# EAGLE design board (EAGLE 9.4.2)

## Sheet 1 of 5: Logika a konektory -ESP32 -konektor na GPS, motor zamku, vivod i2c a zbyle pinhedy pro externi pouyiti
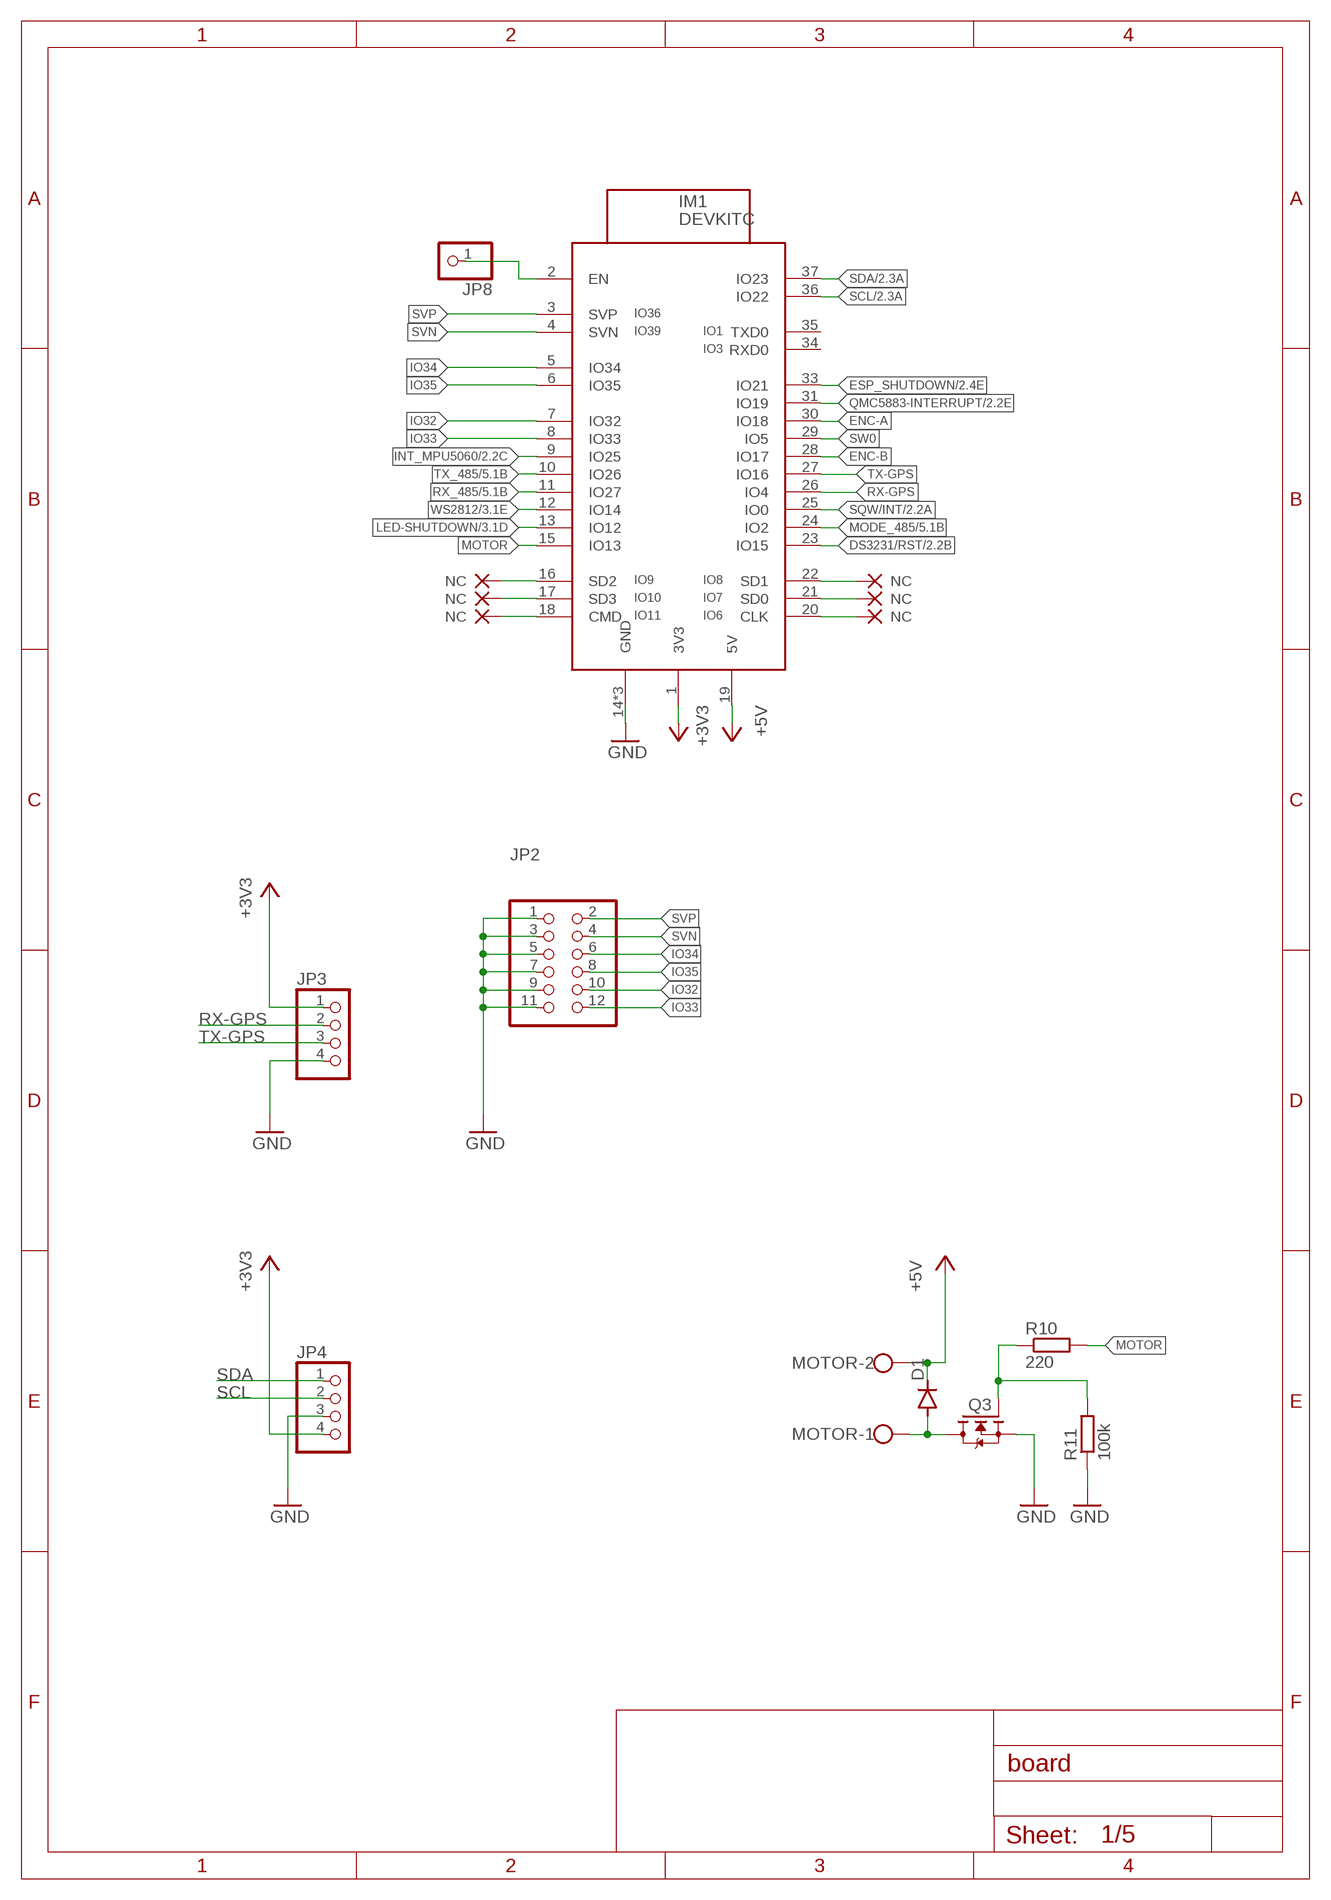
[diagram p0: schematic, sheet 1]

### Parts
D1  DIODE-DO214BA  [DO214BA]
IM1  DEVKITC  [DEVKITC]
JP2  PINHD-2X6  [2X06]
JP3  PINHD-1X4  [1X04]
JP4  PINHD-1X4  [1X04]
JP8  PINHD-1X1  [1X01]
MOTOR  W237-102  [W237-102]
NC1  NC  (no package)
NC2  NC  (no package)
NC3  NC  (no package)
NC4  NC  (no package)
NC5  NC  (no package)
NC6  NC  (no package)
Q3  N-MOSFET-SO8  [SO-8]
R10  220  R-EU_R0402  [R0402]
R11  100k  R-EU_R0402  [R0402]

### Nets
+3V3: IM1.1(3V3) JP3.1 JP4.4 ; also sheet 2,3,5
+5V: D1.C IM1.19(5V) MOTOR.2 ; also sheet 2,3,5
DS3231/RST: IM1.23(IO15) ; also sheet 2
ENC-A: IM1.30(IO18) ; also sheet 2
ENC-B: IM1.28(IO17) ; also sheet 2
ESP_SHUTDOWN: IM1.33(IO21) ; also sheet 2
GND: IM1.14(GND) IM1.32(GND) IM1.38(GND) JP2.1 JP2.3 JP2.5 JP2.7 JP2.9 JP2.11 JP3.4 JP4.3 Q3.1(S) Q3.2(S) Q3.3(S) R11.1 ; also sheet 2,3,4,5
INT_MPU5060: IM1.9(IO25) ; also sheet 2
IO9_NC: IM1.16(SD2) NC1.NC
IO9_NC1: IM1.20(CLK) NC4.NC
IO10_NC: IM1.17(SD3) NC2.NC
IO10_NC1: IM1.21(SD0) NC5.NC
IO11_NC: IM1.18(CMD) NC3.NC
IO11_NC1: IM1.22(SD1) NC6.NC
IO32: IM1.7(IO32) JP2.10
IO33: IM1.8(IO33) JP2.12
IO34: IM1.5(IO34) JP2.6
IO35: IM1.6(IO35) JP2.8
LED-SHUTDOWN: IM1.13(IO12) ; also sheet 3
MODE_485: IM1.24(IO2) ; also sheet 5
MOTOR: IM1.15(IO13) R10.2
N$2: D1.A MOTOR.1 Q3.5(D) Q3.6(D) Q3.7(D) Q3.8(D)
N$10: IM1.2(EN) JP8.1
N$71: Q3.4(G) R10.1 R11.2
QMC5883-INTERRUPT: IM1.31(IO19) ; also sheet 2
RX-GPS: IM1.26(IO4) JP3.2
RX_485: IM1.11(IO27) ; also sheet 5
SCL: IM1.36(IO22) JP4.2 ; also sheet 2
SDA: IM1.37(IO23) JP4.1 ; also sheet 2
SQW/INT: IM1.25(IO0) ; also sheet 2
SVN: IM1.4(SVN) JP2.4
SVP: IM1.3(SVP) JP2.2
SW0: IM1.29(IO5) ; also sheet 2
TX-GPS: IM1.27(IO16) JP3.3
TX_485: IM1.10(IO26) ; also sheet 5
WS2812: IM1.12(IO14) ; also sheet 3
Unconnected: IM1.34(RXD0) IM1.35(TXD0)

## Sheet 2 of 5
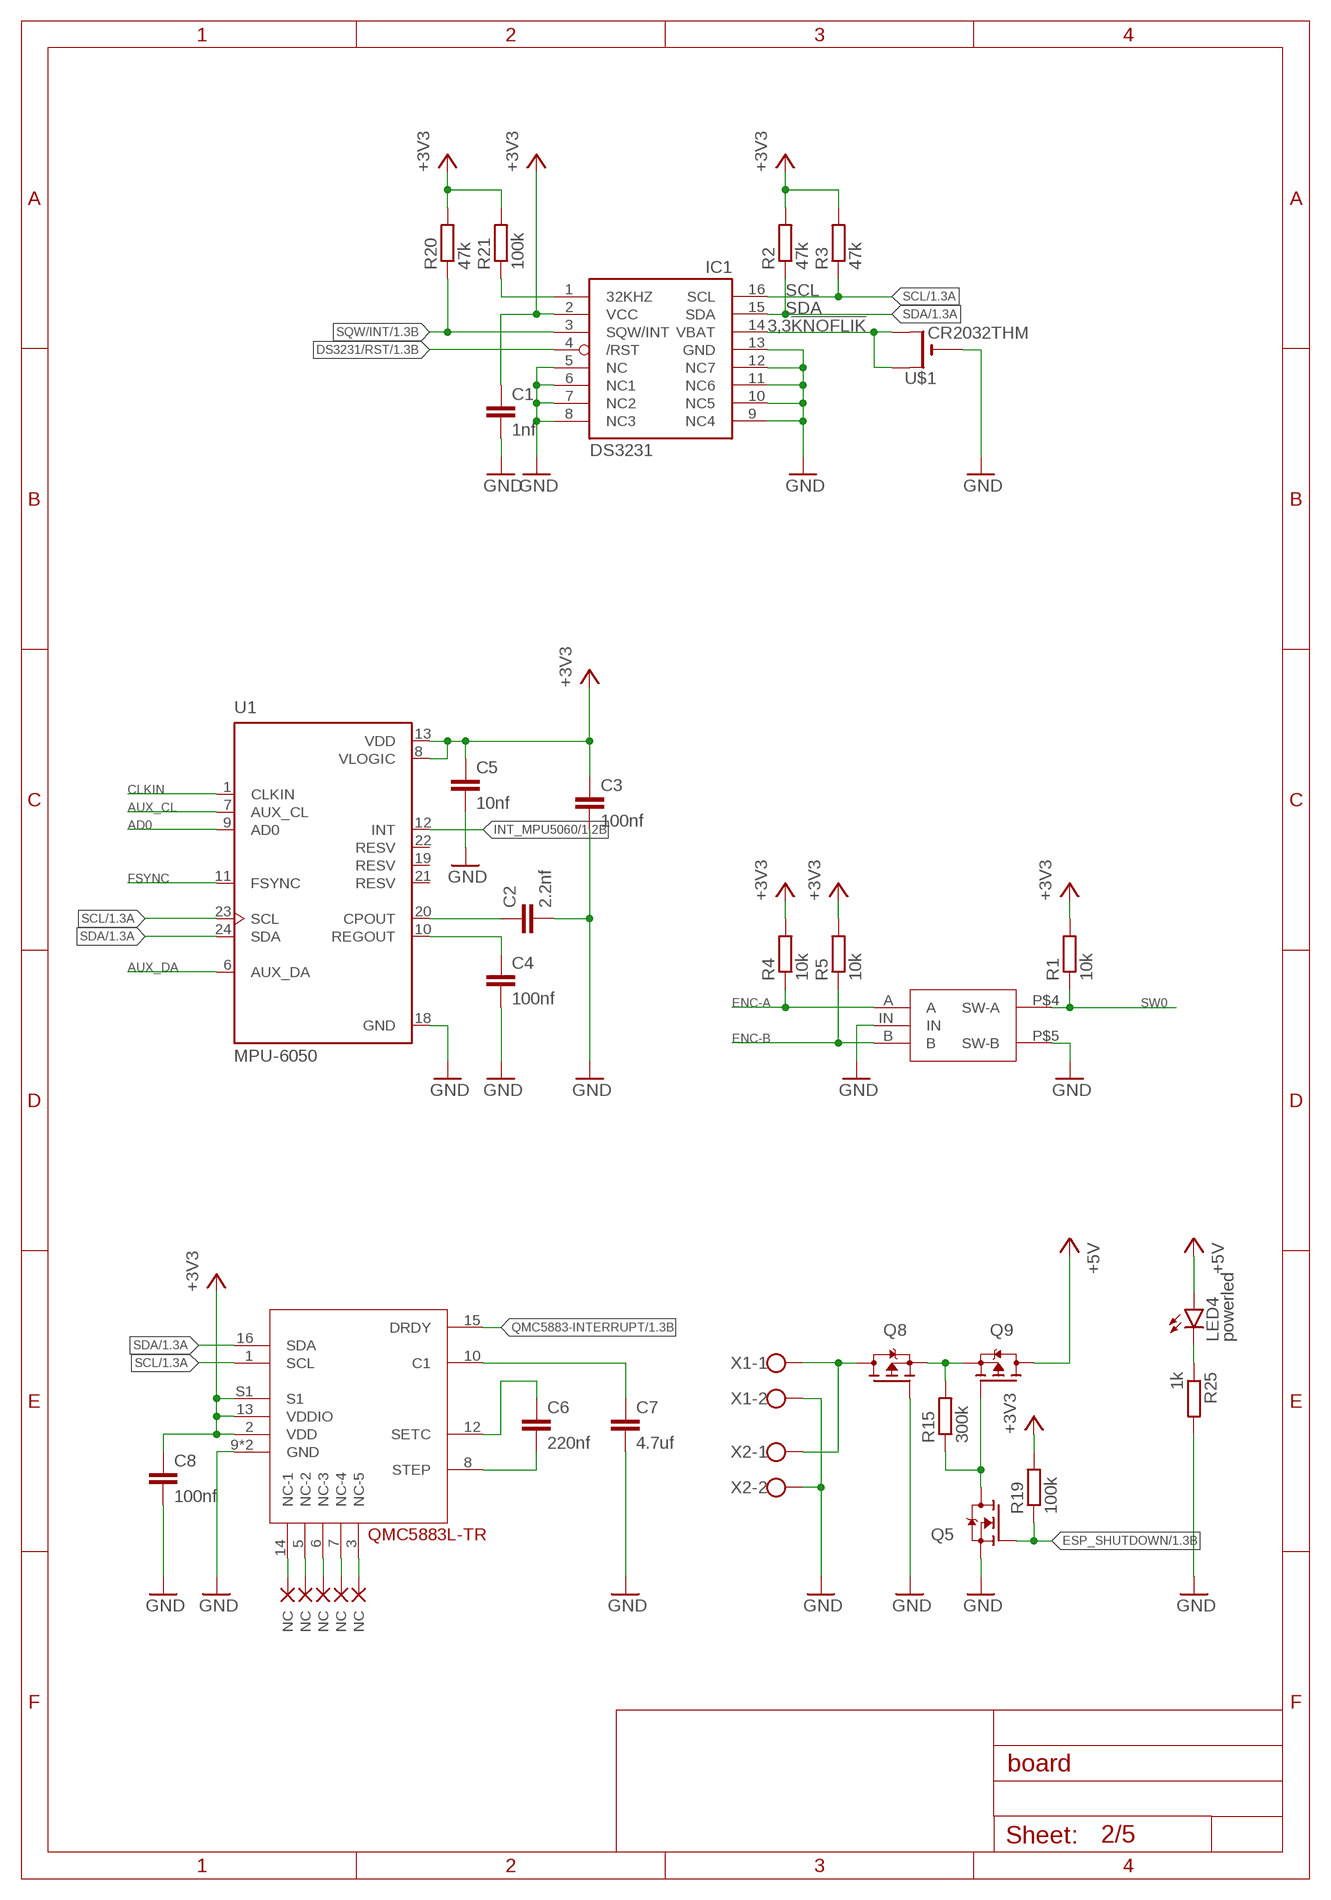
[diagram p1: schematic, sheet 2]

### Parts
C1  1nf  C-EUC0402K  [C0402K]
C2  2.2nf  C-EUC0402K  [C0402K]
C3  100nf  C-EUC0402K  [C0402K]
C4  100nf  C-EUC0402K  [C0402K]
C5  10nf  C-EUC0402K  [C0402K]
C6  220nf  C-EUC0402K  [C0402K]
C7  4.7uf  C-EUC0603  [C0603]
C8  100nf  C-EUC0402K  [C0402K]
IC1  DS3231/SO  [SO16W]
IC2  QMC5883L-TR  [QMC5882L-TR]
LED4  powerled  LEDSML0603  [SML0603]
NC7  NC  (no package)
NC9  NC  (no package)
NC10  NC  (no package)
NC11  NC  (no package)
NC12  NC  (no package)
Q5  N-MOSFET-SOT23-GSD  [SOT23]
Q8  BSO201SP  [SO-8]
Q9  BSO201SP  [SO-8]
R1  10k  R-EU_R0402  [R0402]
R2  47k  R-EU_R0402  [R0402]
R3  47k  R-EU_R0402  [R0402]
R4  10k  R-EU_R0402  [R0402]
R5  10k  R-EU_R0402  [R0402]
R15  300k  R-EU_R0603  [R0603]
R19  100k  R-EU_R0402  [R0402]
R20  47k  R-EU_R0603  [R0603]
R21  100k  R-EU_R0603  [R0603]
R25  1k  R-EU_R0402  [R0402]
U1  MPU-6050  [QFN50P400X400X95-24N]
U$1  CR2032THM  [CR2032-THRU]
U$62  EC11-1S  [EC11-1S]
X1  W237-102  [W237-102]
X2  W237-102  [W237-102]

### Nets
3,3!KNOFLIK: IC1.14(VBAT) U$1.+1(+) U$1.+2(+1)
+3V3: C1.1 C3.1 C5.1 C8.1 IC1.2(VCC) IC2.2(VDD) IC2.13(VDDIO) IC2.S1 R1.2 R2.2 R3.2 R4.2 R5.2 R19.2 R20.2 R21.2 U1.8(VLOGIC) U1.13(VDD) ; also sheet 1,3,5
+5V: LED4.A Q9.5(D) Q9.6(D) Q9.7(D) Q9.8(D) ; also sheet 1,3,5
AD0: U1.9(AD0)
AUX_CL: U1.7(AUX_CL)
AUX_DA: U1.6(AUX_DA)
CLKIN: U1.1(CLKIN)
DS3231/RST: IC1.4(/RST) ; also sheet 1
ENC-A: R4.1 U$62.A ; also sheet 1
ENC-B: R5.1 U$62.B ; also sheet 1
ESP_SHUTDOWN: Q5.1(G) R19.1 ; also sheet 1
FSYNC: U1.11(FSYNC)
GND: C1.2 C2.2 C3.2 C4.2 C5.2 C7.2 C8.2 IC1.5(NC) IC1.6(NC1) IC1.7(NC2) IC1.8(NC3) IC1.9(NC4) IC1.10(NC5) IC1.11(NC6) IC1.12(NC7) IC1.13(GND) IC2.9(GND) IC2.11(GND) Q5.2(S) Q8.4(G) R25.2 U1.18(GND) U$1.- U$62.IN U$62.P$5(SW-B) X1.2 X2.2 ; also sheet 1,3,4,5
INT_MPU5060: U1.12(INT) ; also sheet 1
IO9_NC2: IC2.14(NC-1) NC7.NC
IO9_NC3: IC2.7(NC-4) NC11.NC
IO10_NC2: IC2.5(NC-2) NC9.NC
IO10_NC3: IC2.3(NC-5) NC12.NC
IO11_NC2: IC2.6(NC-3) NC10.NC
LED4: LED4.C R25.1
N$1: C2.1 U1.20(CPOUT)
N$3: C4.1 U1.10(REGOUT)
N$4: Q8.5(D) Q8.6(D) Q8.7(D) Q8.8(D) X1.1 X2.1
N$5: Q8.1(S) Q8.2(S) Q8.3(S) Q9.1(S) Q9.2(S) Q9.3(S) R15.2
N$6: Q5.3(D) Q9.4(G) R15.1
N$7: IC1.1(32KHZ) R21.1
N$60: C6.1 IC2.12(SETC)
N$62: C6.2 IC2.8(STEP)
N$66: C7.1 IC2.10(C1)
QMC5883-INTERRUPT: IC2.15(DRDY) ; also sheet 1
SCL: IC1.16(SCL) IC2.1(SCL) R3.1 U1.23(SCL) ; also sheet 1
SDA: IC1.15(SDA) IC2.16(SDA) R2.1 U1.24(SDA) ; also sheet 1
SQW/INT: IC1.3(SQW/INT) R20.1 ; also sheet 1
SW0: R1.1 U$62.P$4(SW-A) ; also sheet 1
Unconnected: U1.19(RESV) U1.21(RESV) U1.22(RESV)

## Sheet 3 of 5
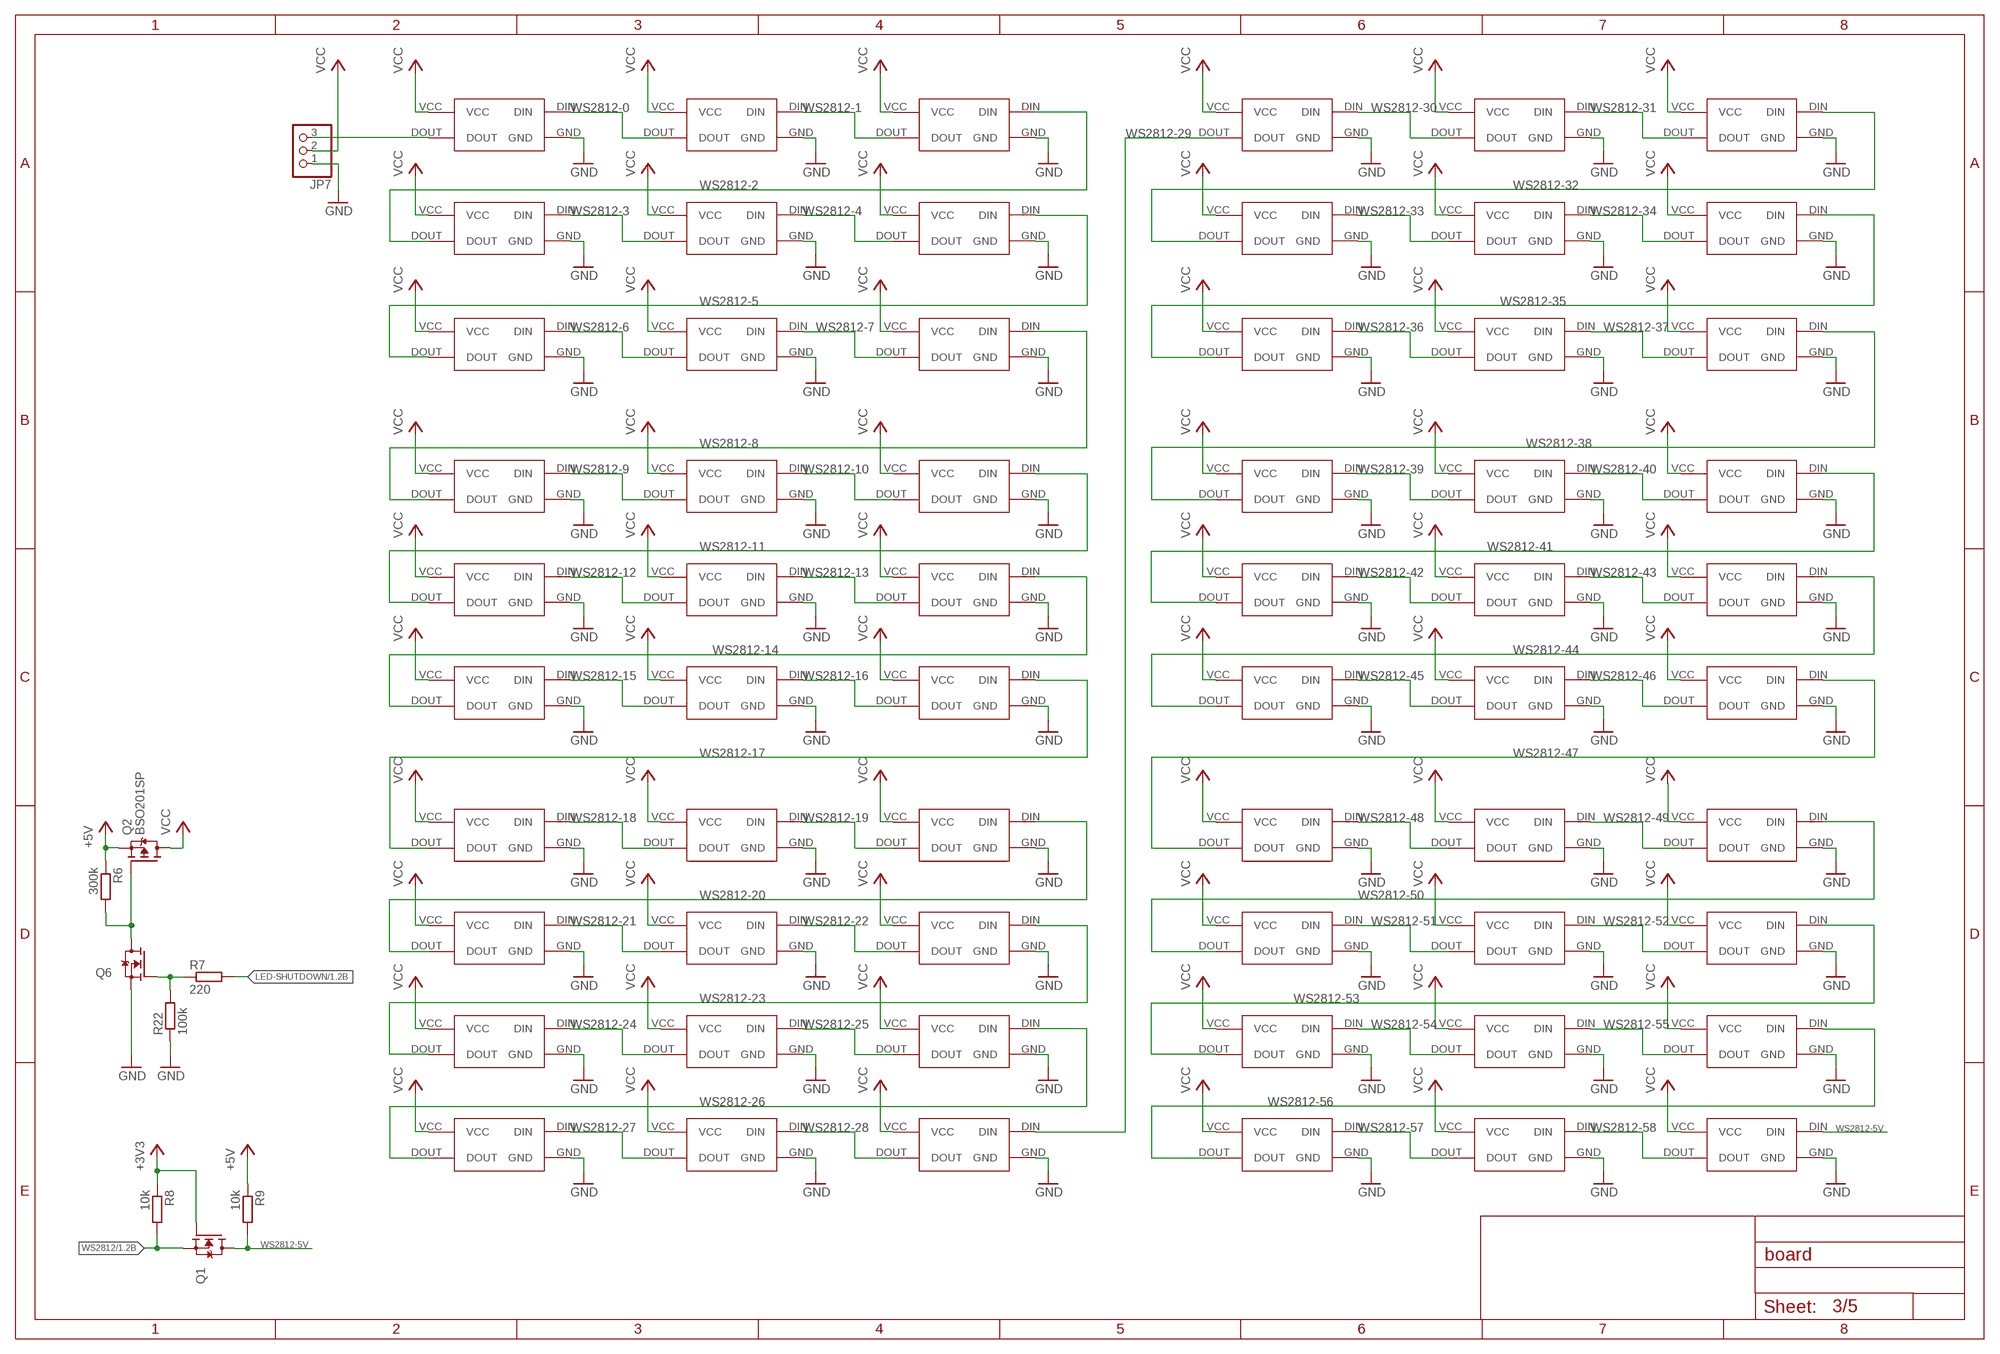
[diagram p2: schematic, sheet 3]

### Parts
JP7  PINHD-1X3  [1X03]
Q1  N-MOSFET-SOT23-GSD  [SOT23]
Q2  BSO201SP  [SO-8]
Q6  N-MOSFET-SOT23-GSD  [SOT23]
R6  300k  R-EU_R0402  [R0402]
R7  220  R-EU_R0402  [R0402]
R8  10k  R-EU_R0402  [R0402]
R9  10k  R-EU_R0402  [R0402]
R22  100k  R-EU_R0402  [R0402]
U$2  WS2812  [WS2812B-MINI]
U$3  WS2812  [WS2812B-MINI]
U$4  WS2812  [WS2812B-MINI]
U$5  WS2812  [WS2812B-MINI]
U$6  WS2812  [WS2812B-MINI]
U$7  WS2812  [WS2812B-MINI]
U$8  WS2812  [WS2812B-MINI]
U$9  WS2812  [WS2812B-MINI]
U$10  WS2812  [WS2812B-MINI]
U$11  WS2812  [WS2812B-MINI]
U$12  WS2812  [WS2812B-MINI]
U$13  WS2812  [WS2812B-MINI]
U$14  WS2812  [WS2812B-MINI]
U$15  WS2812  [WS2812B-MINI]
U$16  WS2812  [WS2812B-MINI]
U$17  WS2812  [WS2812B-MINI]
U$18  WS2812  [WS2812B-MINI]
U$19  WS2812  [WS2812B-MINI]
U$20  WS2812  [WS2812B-MINI]
U$21  WS2812  [WS2812B-MINI]
U$22  WS2812  [WS2812B-MINI]
U$23  WS2812  [WS2812B-MINI]
U$24  WS2812  [WS2812B-MINI]
U$25  WS2812  [WS2812B-MINI]
U$26  WS2812  [WS2812B-MINI]
U$27  WS2812  [WS2812B-MINI]
U$28  WS2812  [WS2812B-MINI]
U$29  WS2812  [WS2812B-MINI]
U$30  WS2812  [WS2812B-MINI]
U$31  WS2812  [WS2812B-MINI]
U$32  WS2812  [WS2812B-MINI]
U$33  WS2812  [WS2812B-MINI]
U$34  WS2812  [WS2812B-MINI]
U$35  WS2812  [WS2812B-MINI]
U$36  WS2812  [WS2812B-MINI]
U$37  WS2812  [WS2812B-MINI]
U$38  WS2812  [WS2812B-MINI]
U$39  WS2812  [WS2812B-MINI]
U$40  WS2812  [WS2812B-MINI]
U$41  WS2812  [WS2812B-MINI]
U$42  WS2812  [WS2812B-MINI]
U$43  WS2812  [WS2812B-MINI]
U$44  WS2812  [WS2812B-MINI]
U$45  WS2812  [WS2812B-MINI]
U$46  WS2812  [WS2812B-MINI]
U$47  WS2812  [WS2812B-MINI]
U$48  WS2812  [WS2812B-MINI]
U$49  WS2812  [WS2812B-MINI]
U$50  WS2812  [WS2812B-MINI]
U$51  WS2812  [WS2812B-MINI]
U$52  WS2812  [WS2812B-MINI]
U$53  WS2812  [WS2812B-MINI]
U$54  WS2812  [WS2812B-MINI]
U$55  WS2812  [WS2812B-MINI]
U$56  WS2812  [WS2812B-MINI]
U$57  WS2812  [WS2812B-MINI]
U$58  WS2812  [WS2812B-MINI]
U$59  WS2812  [WS2812B-MINI]
U$60  WS2812  [WS2812B-MINI]
U$61  WS2812  [WS2812B-MINI]

### Nets
+3V3: Q1.1(G) R8.1 ; also sheet 1,2,5
+5V: Q2.1(S) Q2.2(S) Q2.3(S) R6.1 R9.1 ; also sheet 1,2,5
GND: JP7.1 Q6.2(S) R22.1 U$2.GND U$3.GND U$4.GND U$5.GND U$6.GND U$7.GND U$8.GND U$9.GND U$10.GND U$11.GND U$12.GND U$13.GND U$14.GND U$15.GND U$16.GND U$17.GND U$18.GND U$19.GND U$20.GND U$21.GND U$22.GND U$23.GND U$24.GND U$25.GND U$26.GND U$27.GND U$28.GND U$29.GND U$30.GND U$31.GND U$32.GND U$33.GND U$34.GND U$35.GND U$36.GND U$37.GND U$38.GND U$39.GND U$40.GND U$41.GND U$42.GND U$43.GND U$44.GND U$45.GND U$46.GND U$47.GND U$48.GND U$49.GND U$50.GND U$51.GND U$52.GND U$53.GND U$54.GND U$55.GND U$56.GND U$57.GND U$58.GND U$59.GND U$60.GND U$61.GND ; also sheet 1,2,4,5
LED-SHUTDOWN: R7.2 ; also sheet 1
N$9: JP7.3 U$2.DOUT
N$47: U$49.DIN U$50.DOUT
N$68: Q2.4(G) Q6.3(D) R6.2
N$69: Q6.1(G) R7.1 R22.2
VCC: JP7.2 Q2.5(D) Q2.6(D) Q2.7(D) Q2.8(D) U$2.VCC U$3.VCC U$4.VCC U$5.VCC U$6.VCC U$7.VCC U$8.VCC U$9.VCC U$10.VCC U$11.VCC U$12.VCC U$13.VCC U$14.VCC U$15.VCC U$16.VCC U$17.VCC U$18.VCC U$19.VCC U$20.VCC U$21.VCC U$22.VCC U$23.VCC U$24.VCC U$25.VCC U$26.VCC U$27.VCC U$28.VCC U$29.VCC U$30.VCC U$31.VCC U$32.VCC U$33.VCC U$34.VCC U$35.VCC U$36.VCC U$37.VCC U$38.VCC U$39.VCC U$40.VCC U$41.VCC U$42.VCC U$43.VCC U$44.VCC U$45.VCC U$46.VCC U$47.VCC U$48.VCC U$49.VCC U$50.VCC U$51.VCC U$52.VCC U$53.VCC U$54.VCC U$55.VCC U$56.VCC U$57.VCC U$58.VCC U$59.VCC U$60.VCC U$61.VCC ; also sheet 4
WS2812: Q1.2(S) R8.2 ; also sheet 1
WS2812-0: U$2.DIN U$3.DOUT
WS2812-1: U$3.DIN U$4.DOUT
WS2812-2: U$4.DIN U$5.DOUT
WS2812-3: U$5.DIN U$6.DOUT
WS2812-4: U$6.DIN U$7.DOUT
WS2812-5: U$7.DIN U$8.DOUT
WS2812-5V: Q1.3(D) R9.2 U$61.DIN
WS2812-6: U$8.DIN U$9.DOUT
WS2812-7: U$9.DIN U$10.DOUT
WS2812-8: U$10.DIN U$11.DOUT
WS2812-9: U$11.DIN U$12.DOUT
WS2812-10: U$12.DIN U$13.DOUT
WS2812-11: U$13.DIN U$14.DOUT
WS2812-12: U$14.DIN U$15.DOUT
WS2812-13: U$15.DIN U$16.DOUT
WS2812-14: U$16.DIN U$17.DOUT
WS2812-15: U$17.DIN U$18.DOUT
WS2812-16: U$18.DIN U$19.DOUT
WS2812-17: U$19.DIN U$20.DOUT
WS2812-18: U$20.DIN U$21.DOUT
WS2812-19: U$21.DIN U$22.DOUT
WS2812-20: U$22.DIN U$23.DOUT
WS2812-21: U$23.DIN U$24.DOUT
WS2812-22: U$24.DIN U$25.DOUT
WS2812-23: U$25.DIN U$26.DOUT
WS2812-24: U$26.DIN U$27.DOUT
WS2812-25: U$27.DIN U$28.DOUT
WS2812-26: U$28.DIN U$29.DOUT
WS2812-27: U$29.DIN U$30.DOUT
WS2812-28: U$30.DIN U$31.DOUT
WS2812-29: U$31.DIN U$32.DOUT
WS2812-30: U$32.DIN U$33.DOUT
WS2812-31: U$33.DIN U$34.DOUT
WS2812-32: U$34.DIN U$35.DOUT
WS2812-33: U$35.DIN U$36.DOUT
WS2812-34: U$36.DIN U$37.DOUT
WS2812-35: U$37.DIN U$38.DOUT
WS2812-36: U$38.DIN U$39.DOUT
WS2812-37: U$39.DIN U$40.DOUT
WS2812-38: U$40.DIN U$41.DOUT
WS2812-39: U$41.DIN U$42.DOUT
WS2812-40: U$42.DIN U$43.DOUT
WS2812-41: U$43.DIN U$44.DOUT
WS2812-42: U$44.DIN U$45.DOUT
WS2812-43: U$45.DIN U$46.DOUT
WS2812-44: U$46.DIN U$47.DOUT
WS2812-45: U$47.DIN U$48.DOUT
WS2812-46: U$48.DIN U$49.DOUT
WS2812-48: U$50.DIN U$51.DOUT
WS2812-49: U$51.DIN U$52.DOUT
WS2812-50: U$52.DIN U$53.DOUT
WS2812-51: U$53.DIN U$54.DOUT
WS2812-52: U$54.DIN U$55.DOUT
WS2812-53: U$55.DIN U$56.DOUT
WS2812-54: U$56.DIN U$57.DOUT
WS2812-55: U$57.DIN U$58.DOUT
WS2812-56: U$58.DIN U$59.DOUT
WS2812-57: U$59.DIN U$60.DOUT
WS2812-58: U$60.DIN U$61.DOUT

## Sheet 4 of 5
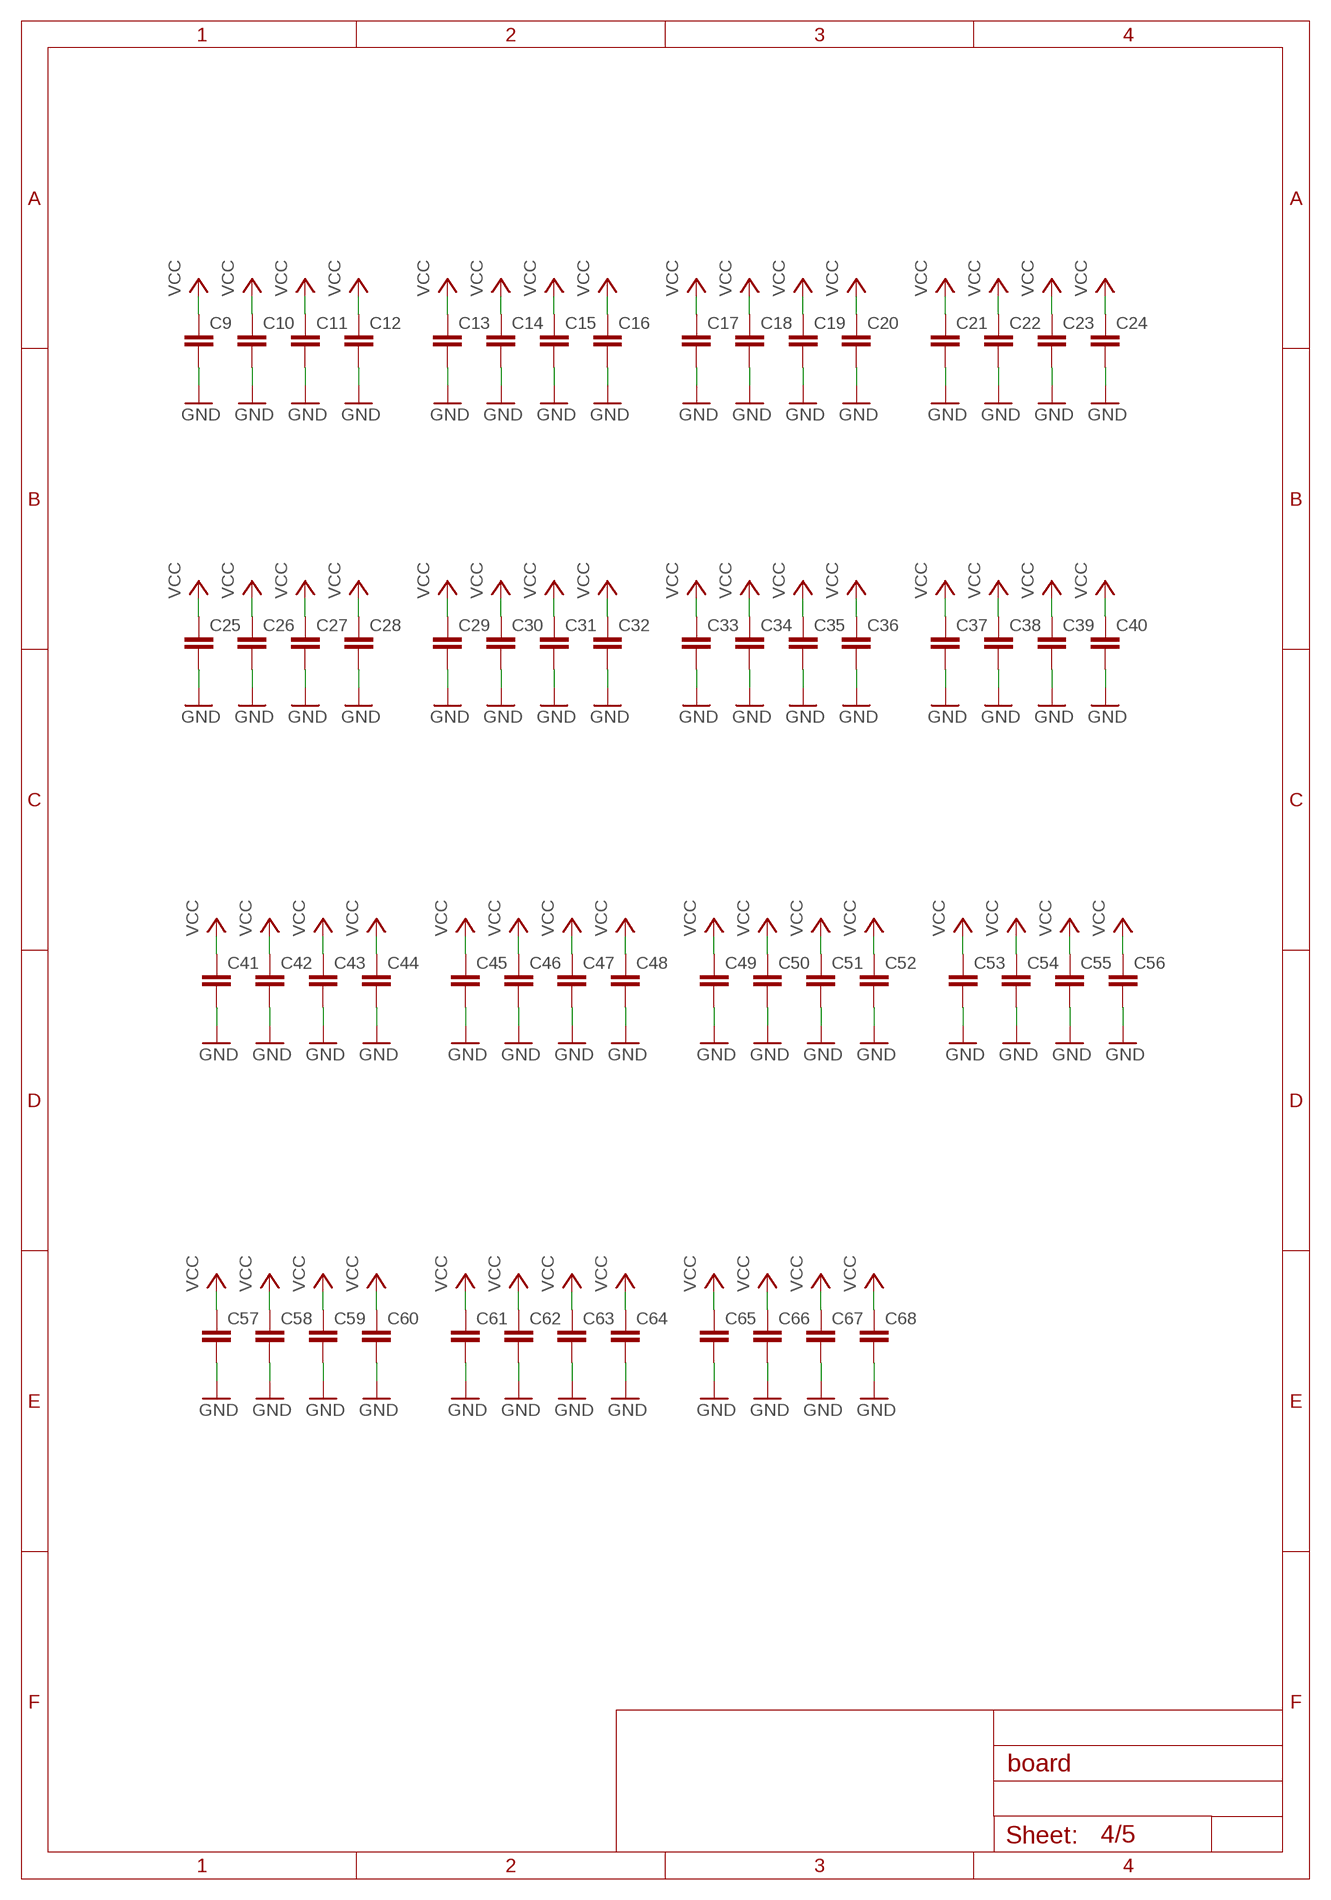
[diagram p3: schematic, sheet 4]

### Parts
C9  C-EUC0402K  [C0402K]
C10  C-EUC0402K  [C0402K]
C11  C-EUC0402K  [C0402K]
C12  C-EUC0402K  [C0402K]
C13  C-EUC0402K  [C0402K]
C14  C-EUC0402K  [C0402K]
C15  C-EUC0402K  [C0402K]
C16  C-EUC0402K  [C0402K]
C17  C-EUC0402K  [C0402K]
C18  C-EUC0402K  [C0402K]
C19  C-EUC0402K  [C0402K]
C20  C-EUC0402K  [C0402K]
C21  C-EUC0402K  [C0402K]
C22  C-EUC0402K  [C0402K]
C23  C-EUC0402K  [C0402K]
C24  C-EUC0402K  [C0402K]
C25  C-EUC0402K  [C0402K]
C26  C-EUC0402K  [C0402K]
C27  C-EUC0402K  [C0402K]
C28  C-EUC0402K  [C0402K]
C29  C-EUC0402K  [C0402K]
C30  C-EUC0402K  [C0402K]
C31  C-EUC0402K  [C0402K]
C32  C-EUC0402K  [C0402K]
C33  C-EUC0402K  [C0402K]
C34  C-EUC0402K  [C0402K]
C35  C-EUC0402K  [C0402K]
C36  C-EUC0402K  [C0402K]
C37  C-EUC0402K  [C0402K]
C38  C-EUC0402K  [C0402K]
C39  C-EUC0402K  [C0402K]
C40  C-EUC0402K  [C0402K]
C41  C-EUC0402K  [C0402K]
C42  C-EUC0402K  [C0402K]
C43  C-EUC0402K  [C0402K]
C44  C-EUC0402K  [C0402K]
C45  C-EUC0402K  [C0402K]
C46  C-EUC0402K  [C0402K]
C47  C-EUC0402K  [C0402K]
C48  C-EUC0402K  [C0402K]
C49  C-EUC0402K  [C0402K]
C50  C-EUC0402K  [C0402K]
C51  C-EUC0402K  [C0402K]
C52  C-EUC0402K  [C0402K]
C53  C-EUC0402K  [C0402K]
C54  C-EUC0402K  [C0402K]
C55  C-EUC0402K  [C0402K]
C56  C-EUC0402K  [C0402K]
C57  C-EUC0402K  [C0402K]
C58  C-EUC0402K  [C0402K]
C59  C-EUC0402K  [C0402K]
C60  C-EUC0402K  [C0402K]
C61  C-EUC0402K  [C0402K]
C62  C-EUC0402K  [C0402K]
C63  C-EUC0402K  [C0402K]
C64  C-EUC0402K  [C0402K]
C65  C-EUC0402K  [C0402K]
C66  C-EUC0402K  [C0402K]
C67  C-EUC0402K  [C0402K]
C68  C-EUC0402K  [C0402K]

### Nets
GND: C9.2 C10.2 C11.2 C12.2 C13.2 C14.2 C15.2 C16.2 C17.2 C18.2 C19.2 C20.2 C21.2 C22.2 C23.2 C24.2 C25.2 C26.2 C27.2 C28.2 C29.2 C30.2 C31.2 C32.2 C33.2 C34.2 C35.2 C36.2 C37.2 C38.2 C39.2 C40.2 C41.2 C42.2 C43.2 C44.2 C45.2 C46.2 C47.2 C48.2 C49.2 C50.2 C51.2 C52.2 C53.2 C54.2 C55.2 C56.2 C57.2 C58.2 C59.2 C60.2 C61.2 C62.2 C63.2 C64.2 C65.2 C66.2 C67.2 C68.2 ; also sheet 1,2,3,5
VCC: C9.1 C10.1 C11.1 C12.1 C13.1 C14.1 C15.1 C16.1 C17.1 C18.1 C19.1 C20.1 C21.1 C22.1 C23.1 C24.1 C25.1 C26.1 C27.1 C28.1 C29.1 C30.1 C31.1 C32.1 C33.1 C34.1 C35.1 C36.1 C37.1 C38.1 C39.1 C40.1 C41.1 C42.1 C43.1 C44.1 C45.1 C46.1 C47.1 C48.1 C49.1 C50.1 C51.1 C52.1 C53.1 C54.1 C55.1 C56.1 C57.1 C58.1 C59.1 C60.1 C61.1 C62.1 C63.1 C64.1 C65.1 C66.1 C67.1 C68.1 ; also sheet 3

## Sheet 5 of 5
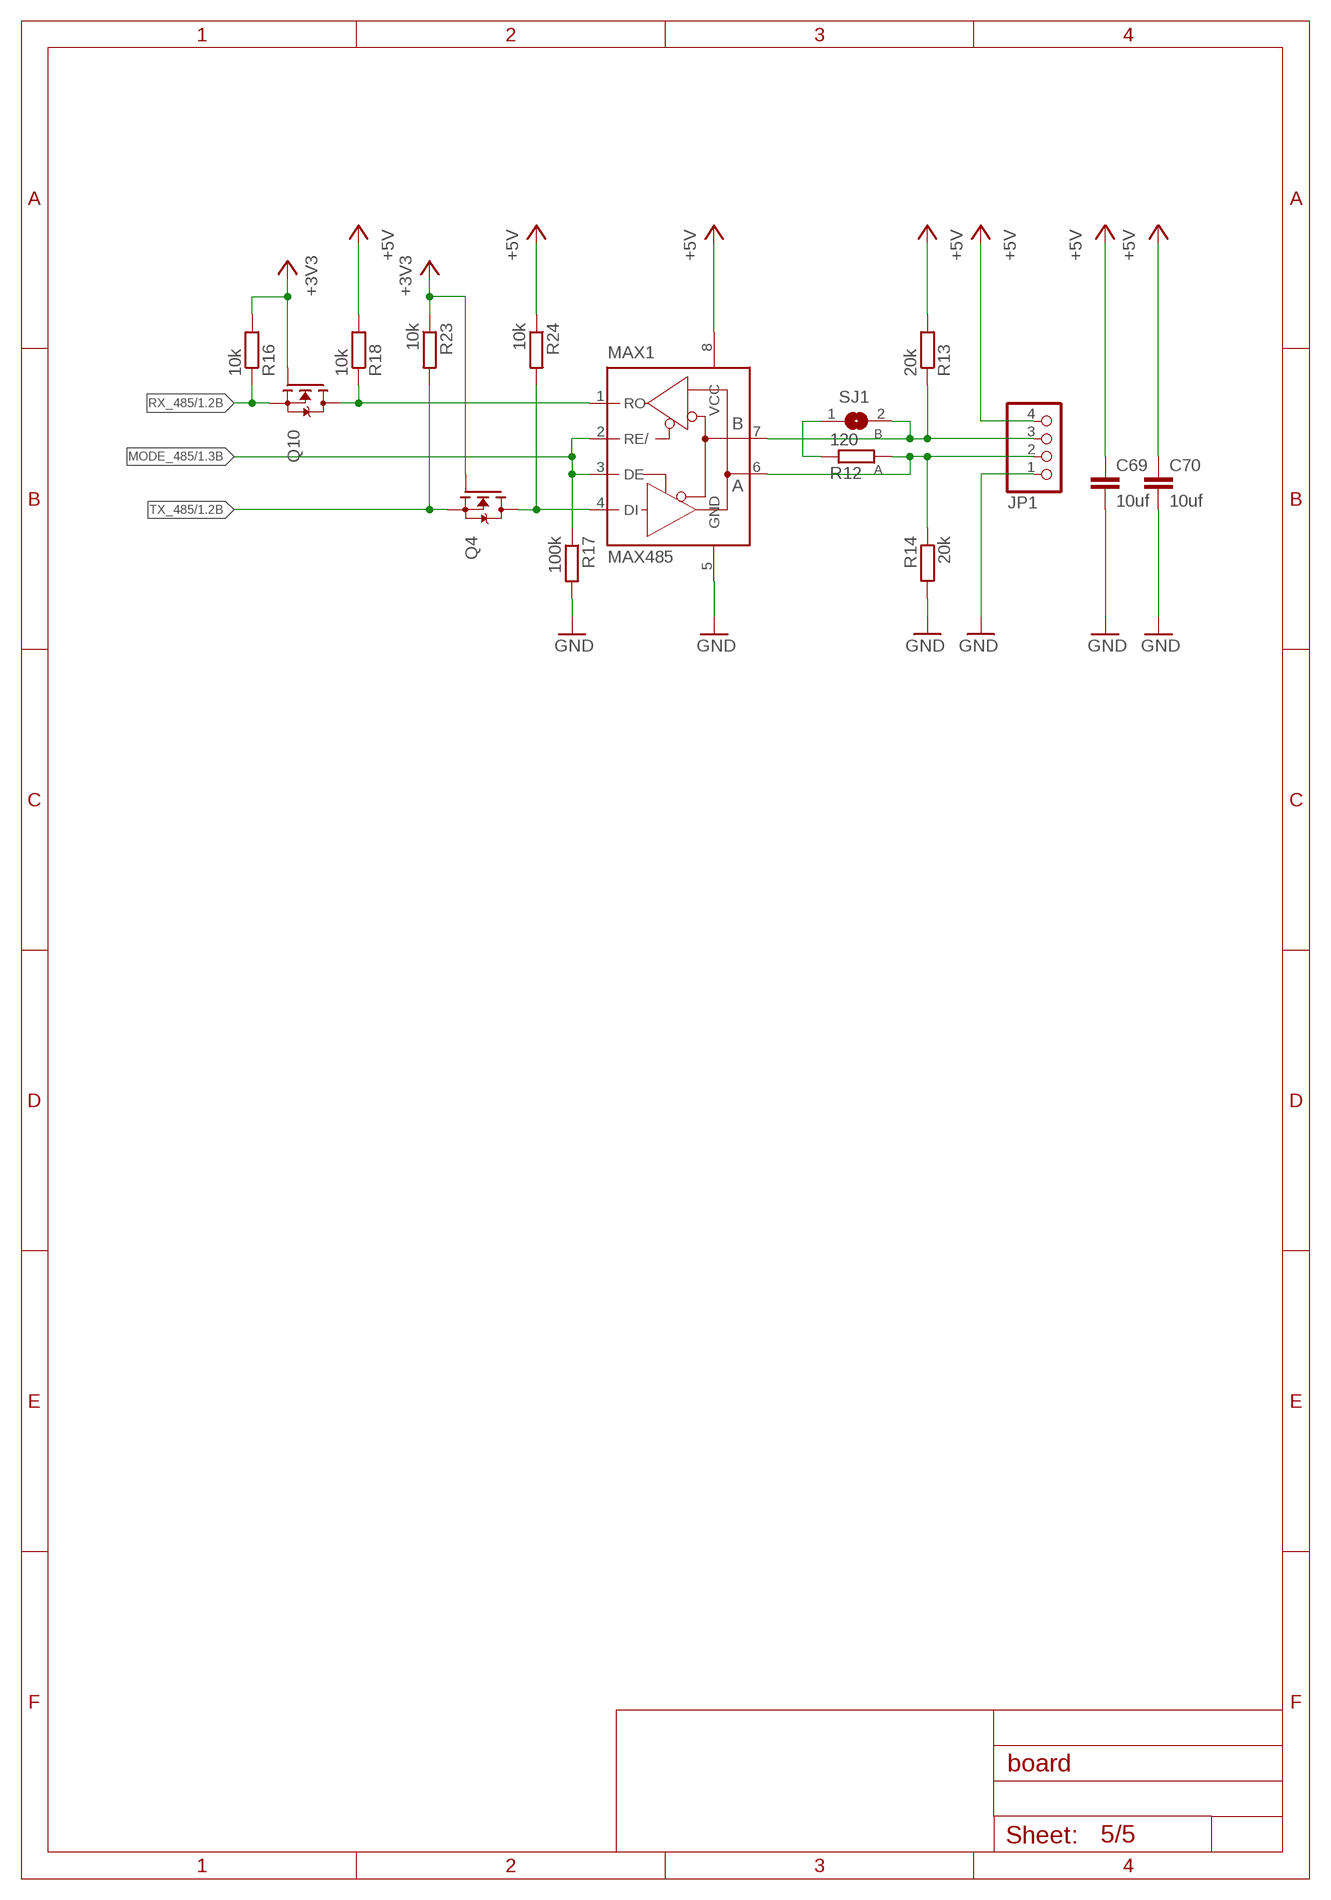
[diagram p4: schematic, sheet 5]

### Parts
C69  10uf  C-EUC0402K  [C0402K]
C70  10uf  C-EUC0402K  [C0402K]
JP1  PINHD-1X4  [1X04]
MAX1  MAX485  [SO08]
Q4  N-MOSFET-SOT23-GSD  [SOT23]
Q10  N-MOSFET-SOT23-GSD  [SOT23]
R12  120  R-EU_R0402  [R0402]
R13  20k  R-EU_R0402  [R0402]
R14  20k  R-EU_R0402  [R0402]
R16  10k  R-EU_R0402  [R0402]
R17  100k  R-EU_R0402  [R0402]
R18  10k  R-EU_R0402  [R0402]
R23  10k  R-EU_R0402  [R0402]
R24  10k  R-EU_R0402  [R0402]
SJ1  SJ  [SJ]

### Nets
+3V3: Q4.1(G) Q10.1(G) R16.2 R23.1 ; also sheet 1,2,3
+5V: C69.1 C70.1 JP1.4 MAX1.8(VCC) R13.2 R18.2 R24.1 ; also sheet 1,2,3
A: JP1.2 MAX1.6(A) R12.2 R14.1
B: JP1.3 MAX1.7(B) R13.1 SJ1.2
GND: C69.2 C70.2 JP1.1 MAX1.5(GND) R14.2 R17.2 ; also sheet 1,2,3,4
MODE_485: MAX1.2(RE/) MAX1.3(DE) R17.1 ; also sheet 1
N$8: R12.1 SJ1.1
RX-485-5V: MAX1.1(RO) Q10.3(D) R18.1
RX_485: Q10.2(S) R16.1 ; also sheet 1
TX_485: Q4.2(S) R23.2 ; also sheet 1
TX_485-5V: MAX1.4(DI) Q4.3(D) R24.2

## Library data of the parts
C1-C70 = rcl:C-EU: CAPACITOR, European symbol; SPICEPREFIX: C
D1 = diode:DIODE-: DIODE
IC1 = DS3231:DS3231; AVAILABILITY: Unavailable; MF: Maxim Integrated; MP: DS3231; PACKAGE: SOIC-16 Maxim Integrated; PRICE: None
IC2 = QMC5883L-TR:QMC5883L-TR
IM1 = esp32:DEVKITC
JP1 JP3 JP4 = pinhead:PINHD-1X4: PIN HEADER
JP2 = pinhead:PINHD-2X6: PIN HEADER
JP7 = pinhead:PINHD-1X3: PIN HEADER
JP8 = pinhead:PINHD-1X1: PIN HEADER
LED4 = led:LED: LED OSRAM: - CHIPLED LG R971, LG N971, LY N971, LG Q971, LY Q971, LO R971, LY R971 LH N974, LH R974 LS Q976, LO Q976, LY Q976 LO Q996 - Hyper CHIPLED LW Q18S LB Q993, LB Q99A, LB R99A - SideLED LS A670, LO A670, LY A670, LG A670, LP A670 LB A673, LV A673, LT A673, LW A673 LH A674 LY A675 LS A676, LA A676, LO A676, LY A676, LW A676 LS A679, LY A679, LG A679 - Hyper Micro SIDELED® LS Y876, LA Y876, LO Y876, LY Y876 LT Y87S - SmartLED LW L88C, LW L88S LB L89C, LB L89S, LG L890 LS L89K, LO L89K, LY L89K LS L896, LA L896, LO L896, LY L896 - TOPLED LS T670, LO T670, LY T670, LG T670, LP T670 LSG T670, LSP T670, LSY T670, LOP T670, LYG T670 LG T671, LOG T671, LSG T671 LB T673, LV T673, LT T673, LW T673 LH T674 LS T676, LA T676, LO T676, LY T676, LB T676, LH T676, LSB T676, LW T676 LB T67C, LV T67C, LT T67C, LS T67K, LO T67K, LY T67K, LW E67C LS E67B, LA E67B, LO E67B, LY E67B, LB E67C, LV E67C, LT E67C LW T67C LS T679, LY T679, LG T679 LS T770, LO T770, LY T770, LG T770, LP T770 LB T773, LV T773, LT T773, LW T773 LH T774 LS E675, LA E675, LY E675, LS T675 LS T776, LA T776, LO T776, LY T776, LB T776 LHGB T686 LT T68C, LB T68C - Hyper Mini TOPLED® LB M676 - Mini TOPLED Santana® LG M470 LS M47K, LO M47K, LY M47K Source: http://www.osram.convergy.de LUXEON: - LUMILED® LXK2-PW12-R00, LXK2-PW12-S00, LXK2-PW14-U00, LXK2-PW14-V00 LXK2-PM12-R00, LXK2-PM12-S00, LXK2-PM14-U00 LXK2-PE12-Q00, LXK2-PE12-R00, LXK2-PE12-S00, LXK2-PE14-T00, LXK2-PE14-U00 LXK2-PB12-K00, LXK2-PB12-L00, LXK2-PB12-M00, LXK2-PB14-N00, LXK2-PB14-P00, LXK2-PB14-Q00 LXK2-PR12-L00, LXK2-PR12-M00, LXK2-PR14-Q00, LXK2-PR14-R00 LXK2-PD12-Q00, LXK2-PD12-R00, LXK2-PD12-S00 LXK2-PH12-R00, LXK2-PH12-S00 LXK2-PL12-P00, LXK2-PL12-Q00, LXK2-PL12-R00 Source: www.luxeon.com KINGBRIGHT: KA-3528ASYC Source: www.kingbright.com
MAX1 = maxim:MAX485
MOTOR X1 X2 = con-wago-500:W237-102: WAGO SCREW CLAMP; MPN: 237-102; OC_FARNELL: unknown; OC_NEWARK: 70K9898
NC1-NC7 NC9-NC12 = NC:NC: _EXTERNAL_
Q1 Q3-Q6 Q10 = transistors:N-MOSFET
Q2 Q8 Q9 = transistor-fet:BSO201SP: OptiMOS(R)-P Small-Signal-Transistor P-Channel, Enhancement mode, Super Logic Level (2.5 V rated) RDS(on) 8mOhm, ID -14.9 a Source: http://www.infineon.com/upload/Document/cmc_upload/documents/011/3655/BSO201SP_211201.pdf
R1-R24 = rcl:R-EU_: RESISTOR, European symbol; SPICEPREFIX: R
R25 = resistor:R-EU_: RESISTOR, European symbol
SJ1 = jumper:SJ: SMD solder JUMPER
U1 = MPU-6050:MPU-6050: MPU-6050 Six-Axis (Gyro + Accelerometer) MEMS MotionTracking™ Devices; AVAILABILITY: Unavailable; DESCRIPTION: 3-axis gyroscope, 3-axis accelerometer in a 4x4x0.9 housing; MF: TDK InvenSense; MP: MPU-6050; PACKAGE: QFN-24 InvenSense; PRICE: None
U$1 = CR2032:CR2032; AVAILABILITY: Unavailable; DESCRIPTION: Battery, LITHIUM High Energy, 3 Volts, 230 mAh, Coin Cell; MF: FDK America,; MP: CR2032; PACKAGE: FDK; PRICE: None
U$2-U$61 = WS2812:WS2812
U$62 = EC11-1S:EC11-1S

## Net classes
0 default: width 0.2 mm, drill 0.35 mm, clearance 0.2 mm

## Board
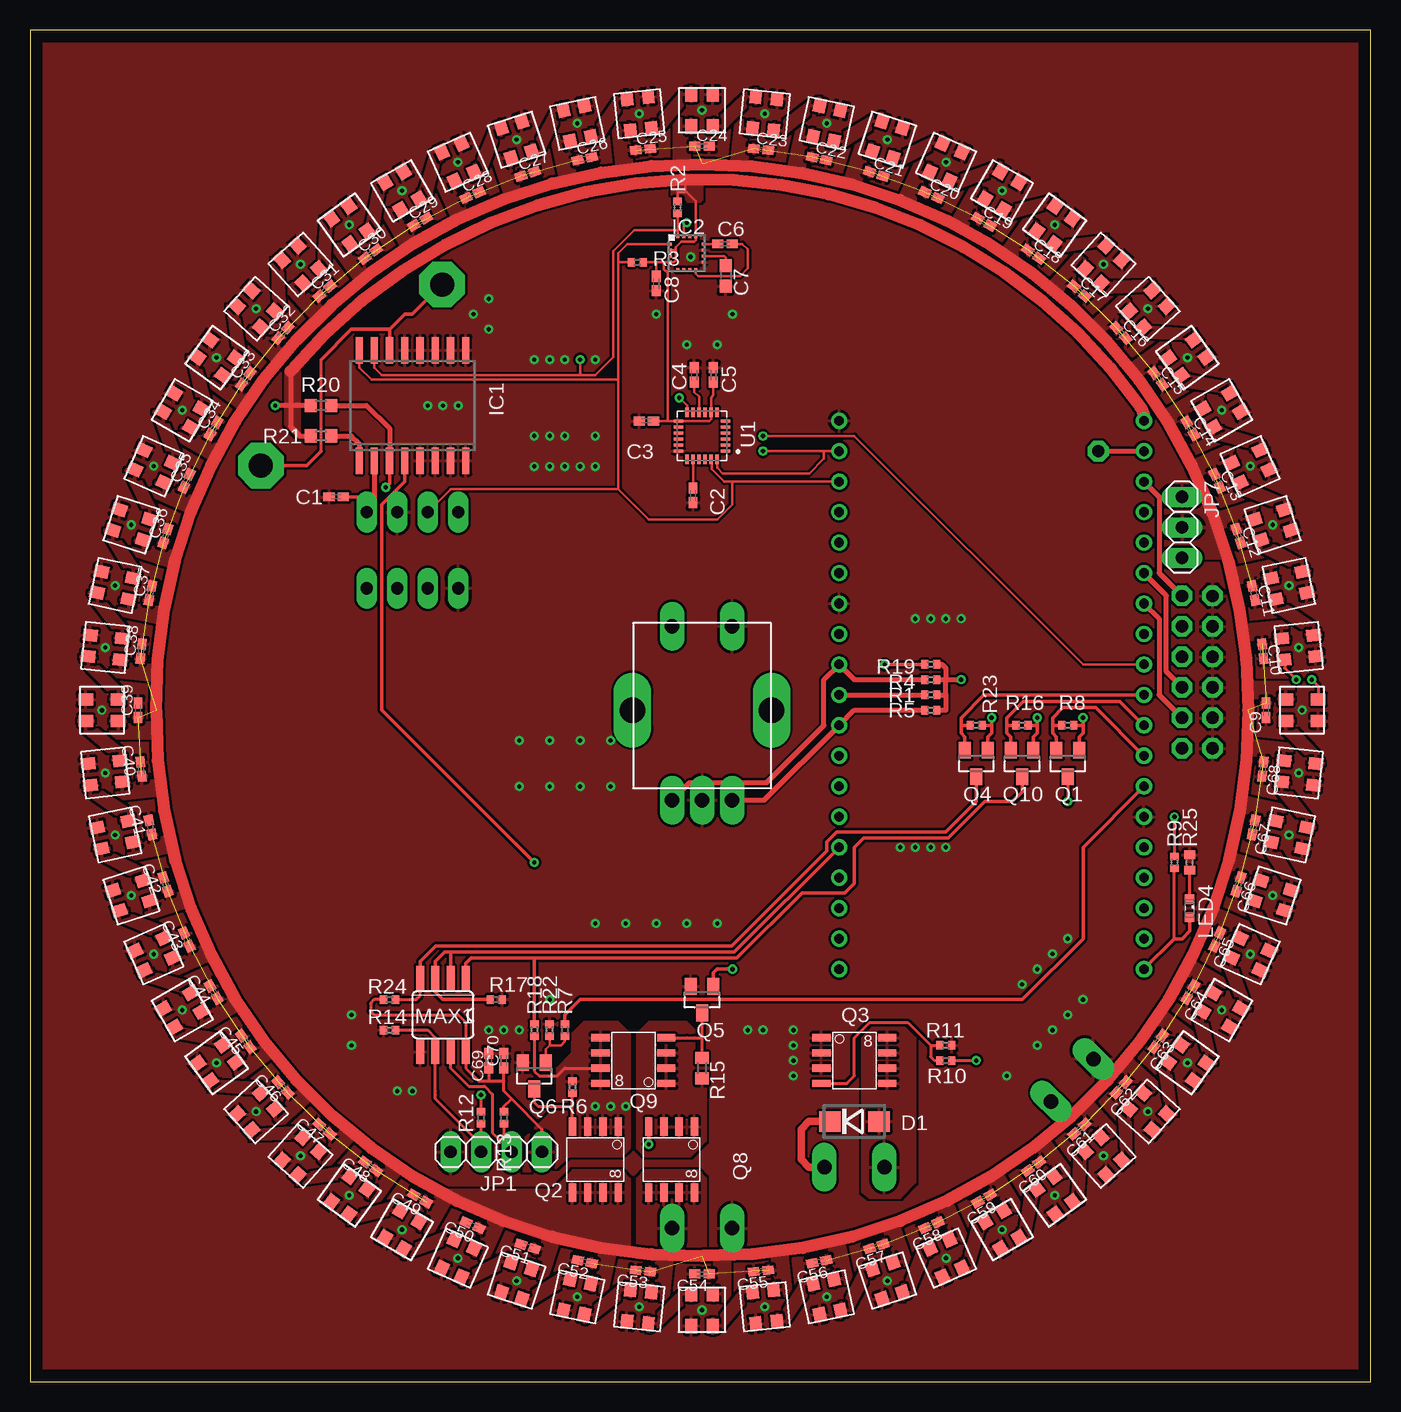
[diagram p5: board, top side]
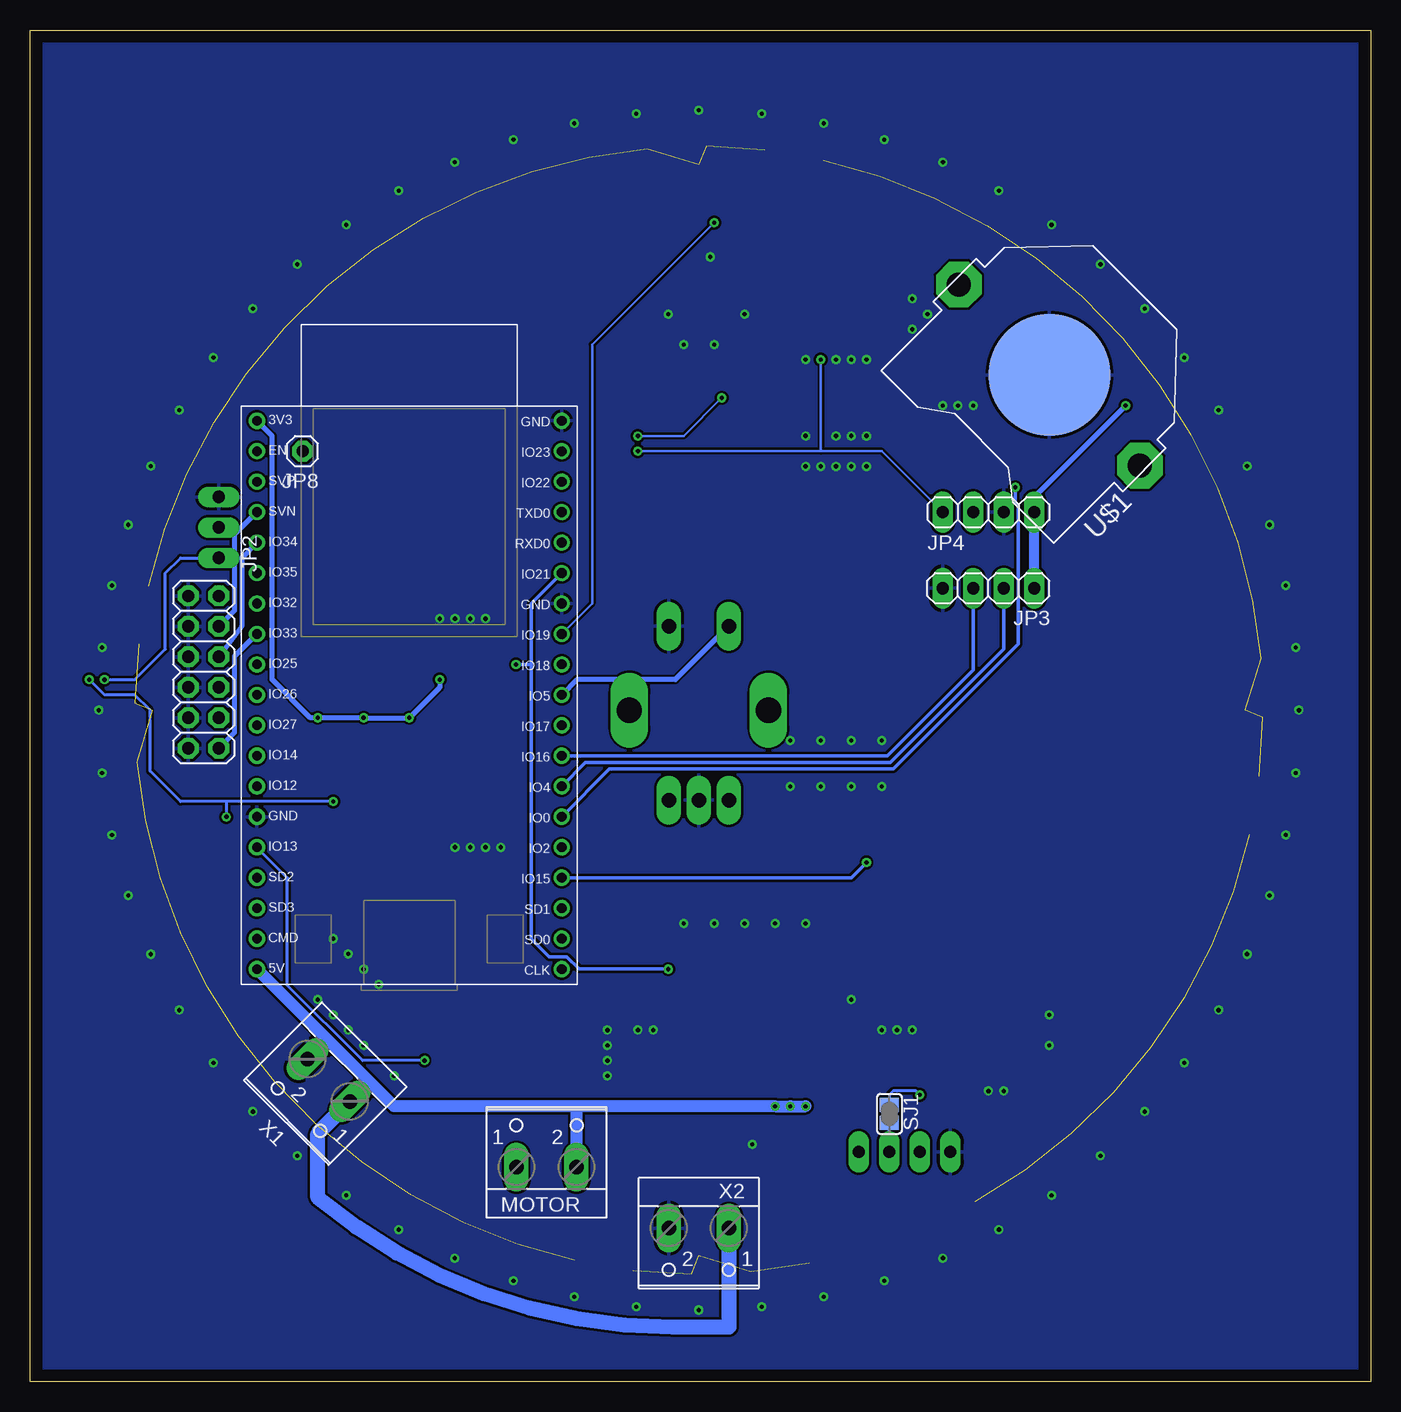
[diagram p6: board, bottom side, seen from below]

Size 111.74 x 112.7 mm. Coordinates in mm from the lower left corner, seen from the top.
Outline: 0,0 111.74,0 111.74,112.7 0,112.7 0,0
Copper layers (1*16): Top 0.035mm / dielectric 1.5mm / Bottom 0.035mm
Design rules "default *": minimum track width 6mil, minimum drill 0.2mm, track to track 6mil, track to pad 6mil, pad to pad 6mil, via to via 6mil, smd to smd 6mil, copper to edge 40mil, drill to drill 6mil, minimum pad ring 10mil, minimum via ring 8mil, stop-mask expansion 4mil, vias tented up to drill 0mil, thermal gap 10mil
tRestrict: 121 lines

### Footprints (pad centres in the part's own frame; a part is rotated, then mirrored left to right if it is on the bottom)
C0402K = smd 0.925 x 0.74: 1 -0.6,0; 2 0.6,0
C0603 = smd 1.1 x 1: 1 -0.85,0; 2 0.85,0
DO214BA = smd 1.8 x 1.7: A 2.05,0; C -2.05,0
SO16W = smd 0.6 x 2.2: 1 -4.445,-4.6; 2 -3.175,-4.6; 3 -1.905,-4.6; 4 -0.635,-4.6; 5 0.635,-4.6; 6 1.905,-4.6; 7 3.175,-4.6; 8 4.445,-4.6; 9 4.445,4.6; 10 3.175,4.6; 11 1.905,4.6; 12 0.635,4.6; 13 -0.635,4.6; 14 -1.905,4.6; 15 -3.175,4.6; 16 -4.445,4.6
QMC5882L-TR = smd 0.325 x 0.25: 1 -1.397,0.762; 2 -1.397,0.254; 3 -1.397,-0.254; 9 1.397,-0.762; 10 1.397,-0.254; 11 1.397,0.254; 12 1.397,0.762; S1 -1.397,-0.762 | smd 0.25 x 0.325: 5 -0.762,-1.397; 6 -0.254,-1.397; 7 0.254,-1.397; 8 0.762,-1.397; 13 0.762,1.397; 14 0.254,1.397; 15 -0.254,1.397; 16 -0.762,1.397
DEVKITC = drill 0.8: 1 -12.7,46.99; 2 -12.7,44.45; 3 -12.7,41.91; 4 -12.7,39.37; 5 -12.7,36.83; 6 -12.7,34.29; 7 -12.7,31.75; 8 -12.7,29.21; 9 -12.7,26.67; 10 -12.7,24.13; 11 -12.7,21.59; 12 -12.7,19.05; 13 -12.7,16.51; 14 -12.7,13.97; 15 -12.7,11.43; 16 -12.7,8.89; 17 -12.7,6.35; 18 -12.7,3.81; 19 -12.7,1.27; 20 12.7,1.27; 21 12.7,3.81; 22 12.7,6.35; 23 12.7,8.89; 24 12.7,11.43; 25 12.7,13.97; 26 12.7,16.51; 27 12.7,19.05; 28 12.7,21.59; 29 12.7,24.13; 30 12.7,26.67; 31 12.7,29.21; 32 12.7,31.75; 33 12.7,34.29; 34 12.7,36.83; 35 12.7,39.37; 36 12.7,41.91; 37 12.7,44.45; 38 12.7,46.99
1X04 = drill 1.016 long: 1 -3.81,0; 2 -1.27,0; 3 1.27,0; 4 3.81,0
2X06 = drill 1.016 octagon: 1 -6.35,-1.27; 2 -6.35,1.27; 3 -3.81,-1.27; 4 -3.81,1.27; 5 -1.27,-1.27; 6 -1.27,1.27; 7 1.27,-1.27; 8 1.27,1.27; 9 3.81,-1.27; 10 3.81,1.27; 11 6.35,-1.27; 12 6.35,1.27
1X03 = drill 1.016 long: 1 -2.54,0; 2 0,0; 3 2.54,0
1X01 = drill 1.016 octagon: 1 0,0
SML0603 = smd 0.8 x 0.8: A 0.75,0; C -0.75,0
SO08 = smd 0.66 x 2.032: 1 -1.905,-3.073; 2 -0.635,-3.073; 3 0.635,-3.073; 4 1.905,-3.073; 5 1.905,3.073; 6 0.635,3.073; 7 -0.635,3.073; 8 -1.905,3.073
W237-102 = drill 1.194 long: 1 -2.5,-1.27; 2 2.5,-1.27
SOT23 = smd 1 x 1.4: 1 -0.95,-1.1; 2 0.95,-1.1; 3 0,1.1
SO-8 = smd 1.524 x 0.61: 1 -2.743,1.905; 2 -2.743,0.635; 3 -2.743,-0.635; 4 -2.743,-1.905; 5 2.743,-1.905; 6 2.743,-0.635; 7 2.743,0.635; 8 2.743,1.905
R0402 = smd 0.6 x 0.7: 1 -0.5,0; 2 0.5,0
R0603 = smd 1 x 1.1: 1 -0.85,0; 2 0.85,0
R0402' = smd 0.7 x 0.9: 1 -0.65,0; 2 0.65,0
SJ = smd 1.168 x 1.6: 1 -0.762,0; 2 0.762,0
QFN50P400X400X95-24N = smd 0.79 x 0.26: 1 -1.97,1.25; 2 -1.97,0.75; 3 -1.97,0.25; 4 -1.97,-0.25; 5 -1.97,-0.75; 6 -1.97,-1.25; 13 1.97,-1.25; 14 1.97,-0.75; 15 1.97,-0.25; 16 1.97,0.25; 17 1.97,0.75; 18 1.97,1.25 | smd 0.26 x 0.79: 7 -1.25,-1.97; 8 -0.75,-1.97; 9 -0.25,-1.97; 10 0.25,-1.97; 11 0.75,-1.97; 12 1.25,-1.97; 19 1.25,1.97; 20 0.75,1.97; 21 0.25,1.97; 22 -0.25,1.97; 23 -0.75,1.97; 24 -1.25,1.97
CR2032-THRU = drill 2 pad 3.81 octagon: +1 -10.668,0; +2 10.668,0 | smd 10.16 x 10.16: - 0,0
WS2812B-MINI = smd 1.2 x 1: DIN 1.34,0.89; DOUT -1.34,-0.89; GND 1.34,-0.89; VCC -1.34,0.89
EC11-1S = drill 1.2 long: A -7.5,2.5; B -7.5,-2.5; IN -7.5,0; P$4 7,2.5; P$5 7,-2.5 | drill 2.1 long: P$1 0,-5.8; P$2 0,5.8

### Placement (x,y rotation side)
C1  25.52,73.78 180 top
C2  55.25,73.9 270 top
C3  51.36,80.11 180 top
C4  55.37,83.94 90 top
C5  56.95,83.94 90 top
C6  57.91,94.86 0 top
C7  57.97,92.19 270 top
C8  52.19,91.56 270 top
C9  103,56 270 top
C10  102.74,60.91 276 top
C11  101.97,65.77 282 top
C12  100.7,70.52 288 top
C13  98.94,75.12 294 top
C14  96.7,79.5 300 top
C15  94.02,83.63 306 top
C16  90.93,87.45 312 top
C17  87.45,90.93 318 top
C18  83.63,94.02 324 top
C19  79.5,96.7 330 top
C20  75.12,98.94 336 top
C21  70.52,100.7 342 top
C22  65.77,101.97 348 top
C23  60.91,102.74 354 top
C24  56,103 0 top
C25  51.09,102.74 6 top
C26  46.23,101.97 12 top
C27  41.48,100.7 18 top
C28  36.88,98.94 24 top
C29  32.5,96.7 30 top
C30  28.37,94.02 36 top
C31  24.55,90.93 42 top
C32  21.07,87.45 48 top
C33  17.98,83.63 54 top
C34  15.3,79.5 60 top
C35  13.06,75.12 66 top
C36  11.3,70.52 72 top
C37  10.03,65.77 78 top
C38  9.26,60.91 84 top
C39  9,56 90 top
C40  9.26,51.09 96 top
C41  10.03,46.23 102 top
C42  11.3,41.48 108 top
C43  13.06,36.88 114 top
C44  15.3,32.5 120 top
C45  17.98,28.37 126 top
C46  21.07,24.55 132 top
C47  24.55,21.07 138 top
C48  28.37,17.98 144 top
C49  32.5,15.3 150 top
C50  36.88,13.06 156 top
C51  41.48,11.3 162 top
C52  46.23,10.03 168 top
C53  51.09,9.26 174 top
C54  56,9 180 top
C55  60.91,9.26 186 top
C56  65.77,10.03 192 top
C57  70.52,11.3 198 top
C58  75.12,13.06 204 top
C59  79.5,15.3 210 top
C60  83.63,17.98 216 top
C61  87.45,21.07 222 top
C62  90.93,24.55 228 top
C63  94.02,28.37 234 top
C64  96.7,32.5 240 top
C65  98.94,36.88 246 top
C66  100.7,41.48 252 top
C67  101.97,46.23 258 top
C68  102.74,51.09 264 top
C69  38.22,26.79 90 top
C70  39.49,26.79 90 top
D1  68.7,21.71 0 top
IC1  31.87,81.4 0 top
IC2  54.73,94.1 0 top
IM1  80.13,33.14 0 bottom
JP1  38.86,19.17 0 top
JP2  97.28,59.17 270 bottom
JP3  31.87,66.16 180 bottom
JP4  31.87,72.51 0 bottom
JP7  96.01,71.24 270 top
JP8  89.02,77.59 180 bottom
LED4  96.64,39.49 270 top
MAX1  34.41,30.6 180 top
MOTOR  68.7,19.17 0 bottom
Q1  86.48,51.55 180 top
Q2  47.11,18.53 270 top
Q3  68.7,26.79 0 top
Q4  78.86,51.55 180 top
Q5  56,31.87 180 top
Q6  42.03,25.52 180 top
Q8  53.46,18.53 270 top
Q9  50.29,26.79 180 top
Q10  82.67,51.55 180 top
R1  75.05,57.27 0 top
R2  53.97,97.91 90 top
R3  50.6,93.34 0 top
R4  75.05,58.54 0 top
R5  75.05,56 0 top
R6  45.21,24.57 270 top
R7  44.57,29.33 90 top
R8  86.48,54.73 180 top
R9  95.37,43.3 90 top
R10  76.32,26.79 0 top
R11  76.32,28.06 180 top
R12  37.59,22.03 270 top
R13  39.49,22.03 90 top
R14  29.97,29.33 180 top
R15  56,26.15 270 top
R16  82.67,54.73 0 top
R17  38.86,31.87 0 top
R18  42.03,29.33 270 top
R19  75.05,59.81 0 top
R20  24.25,81.4 180 top
R21  24.25,78.86 180 top
R22  43.3,29.33 270 top
R23  78.86,54.73 180 top
R24  29.97,31.87 0 top
R25  1k  [R0402']  96.64,43.3 90 top
SJ1  40.13,22.34 270 bottom
U1  56,78.86 180 top
U$1  26.79,83.94 135 bottom
U$2  105.73,61.23 6 top
U$3  104.91,66.4 12 top
U$4  103.55,71.45 18 top
U$5  101.68,76.34 24 top
U$6  99.3,81 30 top
U$7  96.45,85.39 36 top
U$8  93.16,89.46 42 top
U$9  89.46,93.16 48 top
U$10  85.39,96.45 54 top
U$11  81,99.3 60 top
U$12  76.34,101.68 66 top
U$13  71.45,103.55 72 top
U$14  66.4,104.91 78 top
U$15  61.23,105.73 84 top
U$16  56,106 90 top
U$17  50.77,105.73 96 top
U$18  45.6,104.91 102 top
U$19  40.55,103.55 108 top
U$20  35.66,101.68 114 top
U$21  31,99.3 120 top
U$22  26.61,96.45 126 top
U$23  22.54,93.16 132 top
U$24  18.84,89.46 138 top
U$25  15.55,85.39 144 top
U$26  12.7,81 150 top
U$27  10.32,76.34 156 top
U$28  8.45,71.45 162 top
U$29  7.09,66.4 168 top
U$30  6.27,61.23 174 top
U$31  6,56 180 top
U$32  6.27,50.77 186 top
U$33  7.09,45.6 192 top
U$34  8.45,40.55 198 top
U$35  10.32,35.66 204 top
U$36  12.7,31 210 top
U$37  15.55,26.61 216 top
U$38  18.84,22.54 222 top
U$39  22.54,18.84 228 top
U$40  26.61,15.55 234 top
U$41  31,12.7 240 top
U$42  35.66,10.32 246 top
U$43  40.55,8.45 252 top
U$44  45.6,7.09 258 top
U$45  50.77,6.27 264 top
U$46  56,6 270 top
U$47  61.23,6.27 276 top
U$48  66.4,7.09 282 top
U$49  71.45,8.45 288 top
U$50  76.34,10.32 294 top
U$51  81,12.7 300 top
U$52  85.39,15.55 306 top
U$53  89.46,18.84 312 top
U$54  93.16,22.54 318 top
U$55  96.45,26.61 324 top
U$56  99.3,31 330 top
U$57  101.68,35.66 336 top
U$58  103.55,40.55 342 top
U$59  104.91,45.6 348 top
U$60  105.73,50.77 354 top
U$61  106,56 0 top
U$62  56,56 90 top
X1  87.75,24.25 135 bottom
X2  56,11.55 180 bottom

### Tracks (layer width: path | path; a pad name or v marks a point on that pad's centre or on a via)
3,3!KNOFLIK
  Top 0.254: 24.25,77.59 24.25,85.21
  Top 0.305: IC1.14 29.97,87.75 | U$1.+2 31.87,89.02 31.24,89.02 29.97,87.75 | 29.97,87.75 26.79,87.75 24.25,85.21 | U$1.+1 23.06,76.4 24.25,77.59
+3V3  (via drill 0.35)
  Top 0.2: C3.1 53.14,80.11 | 53.14,80.11 U1.13 56.62,80.11 56.75,80.24 U1.8 56.75,81.4 56.75,82.05 56.96,82.25 C5.1 | R3.2 52.19,93.34 | 52.19,93.34 52.83,93.34 | 52.83,93.34 IC2.S1 53.65,93.34 53.8,93.48 53.8,94.35 | C8.1 52.19,93.34 | 54.6,100.23 54.6,99.18 | R2.2 53.97,99.18 54.6,99.18 | 54.6,99.18 54.73,99.18 55.49,98.42 IC2.13 55.49,95.18 55.35,95.03 54.25,95.03 53.8,94.58 53.8,94.35 | IC2.2 53.8,94.35 | 53.14,80.11 53.14,92.45 52.82,92.77 52.82,93.33 52.83,93.34
  Top 0.305: Q4.1 79.81,53.78 80.13,54.09 80.13,54.73 | Q10.1 83.62,53.77 83.94,54.09 83.94,54.73 | 80.13,54.73 R23.1 | R16.2 83.94,54.73 | 80.13,54.73 v80.13,55.36 | 83.94,54.73 v83.94,55.36 | v87.75,55.36 87.75,54.73 | Q1.1 87.43,53.77 87.75,54.09 87.75,54.73 | R8.1 87.75,54.73 | C1.1 28.7,73.78
  Top 0.406: 76.32,57.27 76.32,56 R5.2 | R1.2 76.32,57.27 | R4.2 76.32,58.54 | 76.32,57.27 76.32,58.54 | 76.32,58.54 v77.59,58.54 | 21.71,84.26 21.71,81.4 | 21.71,81.4 21.71,79.65 22.5,78.86 R21.2 | R20.2 21.71,81.4 | IC1.2 28.7,73.78 28.7,73.14 JP4.4 | 21.71,81.4 v20.44,81.4 | R19.2 76,59.81 76.32,59.49 76.32,58.54
  Top 1.016: IM1.1 92.83,80.52 arc33 92.51,81.29 arc57 54.6,100.23 arc48 21.71,84.26
  Bottom 0.406: v77.59,58.54 77.59,57.9 v80.13,55.36 v83.94,55.36 v87.75,55.36 88.39,55.36 91.56,58.54 91.56,78.86 IM1.1 | v20.44,81.4 28.06,73.78 JP4.4
  Bottom 0.813: JP3.1 JP4.4
  pour Top: 21.39,84.55 21.23,84.34 21.23,79.81 22.31,78.73 22.5,78.73 22.5,84.55
  pour Top: 53.46,100.45 53.46,98.87 53.62,98.7 54.49,98.7 54.79,98.4 55.85,98.4 56.01,98.57 56.01,100.44 56,100.45
+5V  (via drill 0.35)
  Top 0.254: 40.13,23.61 39.49,24.25 39.49,25.09 | 40.13,23.61 42.67,21.07 JP1.4 | R18.2 42.03,25.91 42.42,25.52 43.94,25.52 44.57,26.15 Q9.7 | 38.22,25.09 37.38,25.09 36.32,26.15 MAX1.8 36.32,29.96 35.68,30.6 28.7,30.6 28.38,30.92 28.38,31.55 28.7,31.87 R24.1 | C69.1 38.22,25.09 | 38.22,25.09 39.49,25.09 | 39.49,25.09 C70.1 | 95.37,36.95 R9.1 | R13.2 39.49,22.98 40.13,23.61
  Top 0.305: IM1.19 95.37,36.95 96.01,36.95 96.64,37.58 LED4.A
  Top 0.61: D1.C 64.89,21.71 64.26,21.07 64.26,18.53 64.89,17.9 MOTOR.2
  Bottom 1.016: v47.11,22.98 v48.38,22.98 v49.65,22.98 66.16,22.98 | 66.16,22.98 81.4,22.98 IM1.19 | MOTOR.2 66.16,17.94 66.16,22.98
  pour Top: 44.88,18.85 49.33,18.85 49.97,19.49 49.97,29.01 49.02,29.96 46.16,29.96 45.21,29.01 45.21,27.42 43.94,26.15 43.94,22.98 41.08,20.12 41.08,17.61 43.62,17.61
A
  Top 0.254: JP1.2 37.59,20.44 | 37.59,20.44 R12.2 | R14.1 33.14,29.33 33.78,28.69 MAX1.6 33.78,24.25 33.78,23.93 33.78,23.61 36.95,20.44 37.59,20.44
B
  Top 0.254: JP1.3 39.17,20.12 | 39.17,20.12 38.54,20.76 38.54,23.98 37.88,24.64 36.56,24.64 35.05,26.15 MAX1.7 | R13.1 39.49,20.44 39.17,20.12
  Bottom 0.254: JP1.3 SJ1.2
DS3231/RST  (via drill 0.35)
  Top 0.305: v42.03,43.3 29.33,56 29.33,73.14 31.24,75.05 IC1.4
  Bottom 0.305: IM1.23 43.3,42.03 v42.03,43.3
ENC-A
  Top 0.406: R4.1 68.7,58.54 IM1.30 66.16,58.54 66.16,54.73 61.4,49.97 54.97,49.97 U$62.A
ENC-B
  Top 0.406: R5.1 68.7,56 IM1.28 61.2,48.5 U$62.B
ESP_SHUTDOWN  (via drill 0.35)
  Top 0.305: v58.54,34.41 57.27,34.41 56.95,34.09 Q5.1 | R19.1 v71.24,59.81
  Bottom 0.305: IM1.33 69.97,64.89 69.97,59.81 | v58.54,34.41 65.97,34.41 67,35.44 68.46,35.44 69.97,36.95 69.97,59.81 | v71.24,59.81 69.97,59.81
GND  (via drill 0.35)
  Top 0.305: Q8.4 v51.56,19.8
  other vias: 55.05,93.78 40.76,53.46 43.3,53.46 45.84,53.46 45.84,49.65 43.3,49.65 40.76,49.65 48.38,49.65 48.38,53.46 73.78,63.62 75.05,63.62 76.32,63.62 77.59,63.62 72.51,44.57 73.78,44.57 75.05,44.57 76.32,44.57 106.01,56 56,5.99 61.23,6.27 66.4,7.09 71.45,8.44 76.34,10.32 81,12.69 85.39,15.54 89.46,18.84 93.16,22.54 96.46,26.61 99.31,31 101.68,35.66 103.56,40.55 104.91,45.6 105.73,50.77 105.73,61.23 104.91,66.4 103.56,71.45 101.68,76.34 99.31,81 96.46,85.39 93.16,89.46 89.46,93.16 85.39,96.46 81,99.31 76.34,101.68 71.45,103.56 66.4,104.91 61.23,105.73 56,106.01 50.77,105.73 45.6,104.91 40.55,103.56 35.66,101.68 31,99.31 26.61,96.46 22.54,93.16 18.84,89.46 15.54,85.39 12.69,81 10.32,76.34 8.44,71.45 7.09,66.4 6.27,61.23 5.99,56 6.27,50.77 7.09,45.6 8.44,40.55 10.32,35.66 12.69,31 15.54,26.61 18.84,22.54 22.54,18.84 26.61,15.54 31,12.69 35.66,10.32 40.55,8.44 45.6,7.09 50.77,6.27 43.3,31.87 38.22,29.33 39.49,29.33 40.76,29.33 31.87,24.25 30.6,24.25 26.79,30.6 26.79,28.06 63.62,25.52 63.62,26.79 63.62,28.06 63.62,29.33 83.94,28.06 85.21,29.33 86.48,30.6 87.75,31.87 81.4,25.52 86.48,36.95 82.67,33.14 83.94,34.41 85.21,35.68 61.08,29.33 59.81,29.33 57.27,38.22 54.73,38.22 52.19,38.22 49.65,38.22 47.11,38.22 42.03,76.32 43.3,76.32 44.57,76.32 42.03,78.86 43.3,78.86 44.57,78.86 36.95,89.02 38.22,87.75 38.22,90.29 52.19,89.02 58.54,89.02 54.73,86.48 57.27,86.48 47.11,76.32 45.84,76.32 47.11,78.86 42.03,85.21 43.3,85.21 44.57,85.21 47.11,85.21 33.14,81.4 34.41,81.4 35.68,81.4
  pour Top (rank 6): -1.15,114.42 -1.15,-1.15 113.15,-1.15 113.15,114.42
  pour Bottom: -2.42,115.69 -2.42,-2.42 114.42,-2.42 114.42,115.69
INT_MPU5060  (via drill 0.35)
  Top 0.2: U1.12 54.75,81.38 v54.1,82.03 | IM1.9 87.75,59.81 68.7,78.86 v61.08,78.86
  Bottom 0.2: v54.1,82.03 57.27,78.86 v61.08,78.86
IO32
  Top 0.406: IM1.7 94.1,63.62 94.1,57.27 JP2.10
IO33
  Bottom 0.406: IM1.8 94.71,60.47 94.71,54.12 JP2.12
IO34
  Bottom 0.406: IM1.5 94.1,68.7 94.1,62.98 JP2.6
IO35
  Top 0.406: JP2.8 94.71,59.2 94.71,65.55 IM1.6
LED4
  Top 0.254: LED4.C R25.1
LED-SHUTDOWN
  Top 0.305: R7.2 44.57,30.6 45.84,31.87 82.67,31.87 87.75,36.95 87.75,44.57 IM1.13
MODE_485
  Top 0.305: IM1.24 58.7,35.84 35.05,35.84 | 35.05,35.84 34.57,35.84 33.78,35.04 MAX1.3 33.78,32.5 34.41,31.87 R17.1 | MAX1.2 35.05,35.84
MOTOR  (via drill 0.35)
  Top 0.254: R10.2 v78.86,26.79
  Bottom 0.254: v78.86,26.79 84.03,26.79 90.29,33.05 90.29,42.03 IM1.15
N$1
  Top 0.2: C2.1 U1.20
N$2
  pour Top: 69.34,28.69 69.34,15.84 69.97,15.36 72.51,15.36 73.78,16.63 73.78,28.69 72.83,29.65 70.29,29.65
N$3
  Top 0.2: C4.1 55.37,82.51 55.75,82.13 U1.10
N$4
  Bottom 1.27: X2.1 53.5,4.56 58.21,4.56 arc40 87.75,15.36 87.75,20.71 X1.1
  pour Top: 50.6,16.95 50.6,11.23 51.24,10.6 56,10.6 56.32,10.91 56.32,16.95 55.68,17.58 51.24,17.58
N$5
  pour Top: 50.6,29.01 50.6,19.49 51.24,18.85 55.05,18.85 56.32,20.12 56.32,25.2 55.37,26.15 55.37,29.33 54.73,29.96 51.56,29.96
N$6
  Top 0.254: Q9.4 54.73,28.69 55.37,28.69 56,28.69 | R15.1 56,28.69 | 56,28.69 Q5.3
N$7
  Top 0.406: R21.1 26.79,78.86 27.43,78.22 IC1.1
N$8  (via drill 0.35)
  Top 0.254: R12.1 v37.59,23.93
  Bottom 0.254: v37.59,23.93 37.9,24.25 39.49,24.25 | SJ1.1 40.13,23.93 39.81,24.25 39.49,24.25 | 39.49,24.25
N$9  (via drill 0.35)
  Top 0.254: U$2.DOUT 104.56,59.55 104.56,59.51 v105.53,58.54
  Bottom 0.254: v105.53,58.54 102.99,58.54 100.45,61.08 100.45,67.43 99.18,68.7 JP7.3
N$10
  Top 0.406: JP8.1 IM1.2
N$47
  pour Top: 74.18,11.31 74.76,11.57 75.2,10.64 74.78,10.45 73.36,7.02 72.87,6.87 72.5,8 72.99,8.16
N$60
  Top 0.2: IC2.12 C6.1
N$62
  Top 0.2: C6.2 59.37,94.86 59.81,94.42 59.81,92.83 59.18,92.19 55.68,92.19 55.49,92.39 IC2.8
N$66
  Top 0.2: IC2.10 57.84,93.85 57.97,93.72 C7.1
N$68
  Top 0.254: Q2.4 45.21,22.98 | 45.21,22.98 R6.2 | Q6.3 42.03,23.3 42.35,22.98 45.21,22.98
N$69
  Top 0.2: Q6.1 42.98,27.74 43.3,28.06 R22.2
  Top 0.203: 43.3,28.06 44.25,28.06 44.57,28.38 R7.1
  Top 0.254: R7.1 44.57,28.7
N$71
  Top 0.254: Q3.4 68.07,24.88 68.7,25.52 68.7,28.69 69.97,29.96 73.15,29.96 75.05,28.06 | 75.05,28.06 R11.2 | 75.05,28.06 75.05,27.11 75.37,26.79 R10.1
QMC5883-INTERRUPT  (via drill 0.35)
  Top 0.2: IC2.15 54.48,96.39 v54.73,96.64
  Bottom 0.2: v54.73,96.64 64.89,86.48 64.89,64.89 IM1.31
RX-485-5V
  Top 0.305: MAX1.1 36.32,34.89 36.77,35.34 42.03,35.34 | 42.03,35.34 58.91,35.34 64.33,40.76 67.91,40.76 68.7,41.55 68.7,44.57 69.47,45.33 76.53,45.33 79.57,48.38 81.87,48.38 82.67,49.18 Q10.3 | R18.1 42.03,35.34
RX-GPS
  Bottom 0.305: IM1.26 65.46,51.62 40.06,51.62 30.6,61.08 JP3.2
RX_485
  Top 0.305: Q10.2 81.72,53.78 81.4,54.09 81.4,54.73 | 81.4,54.73 R16.1 | 81.4,54.73 81.4,55.36 82.77,56.73 90.83,56.73 IM1.11
SCL
  Top 0.2: IC2.1 49.78,94.86 49.02,94.1 49.02,93.34 | R3.1 49.02,93.34 | IC1.16 27.43,84.57 28.46,83.54 49.02,83.54 | U1.23 56.82,76.82 56.82,76.08 57.86,75.05 58.54,75.05 | IM1.36 58.54,75.05 | 58.54,75.05 58.54,73.14 57.27,71.87 51.56,71.87 49.02,74.41 | 49.02,93.34 49.02,83.54 | 49.02,83.54 49.02,74.41 | JP4.2 35.05,74.41 49.02,74.41
SDA  (via drill 0.35)
  Top 0.2: R2.1 IC2.16 53.97,96 50.35,96 48.62,94.27 48.62,85.44 47.11,83.94 45.84,83.94 | IC1.15 28.7,84.57 29.33,83.94 45.84,83.94 | U1.24 57.25,76.22 57.75,75.72 64.93,75.72 66.16,76.95 66.16,77.59 | 45.84,83.94 v45.84,85.21 | v61.08,77.59 66.16,77.59 | 66.16,77.59 IM1.37
  Bottom 0.2: JP4.1 40.76,77.59 45.84,77.59 | 45.84,77.59 v61.08,77.59 | v45.84,85.21 45.84,77.59
SQW/INT  (via drill 0.35)
  Top 0.305: IC1.3 29.97,74.89 v29.65,74.57
  Top 0.406: R20.1 28.06,81.4 29.97,79.49 IC1.3
  Bottom 0.305: v29.65,74.57 29.65,73.28 29.38,73.01 29.38,61.5 39.81,51.08 63.46,51.08 IM1.25
SVN
  Bottom 0.406: IM1.4 94.71,70.63 94.71,64.28 JP2.4
SVP
  Top 0.406: IM1.3 94.1,73.78 94.1,67.43 JP2.2
SW0
  Top 0.406: IM1.29 R1.1
  Bottom 0.406: U$62.P$4 57.96,58.54 66.16,58.54 IM1.29
TX-GPS
  Bottom 0.305: IM1.27 40.28,52.19 33.14,59.33 JP3.3
TX_485
  Top 0.305: Q4.2 77.91,53.77 77.59,54.09 77.59,54.73 | 77.59,54.73 R23.2 | IM1.10 79.5,57.27 77.59,55.36 77.59,54.73
TX_485-5V
  Top 0.254: R24.2 32.19,31.87 32.51,32.19 MAX1.4
  Top 0.305: MAX1.4 32.51,35.04 33.81,36.35 58.49,36.35 66.4,44.25 66.4,45 67.24,45.84 76.32,45.84 78.86,48.38 Q4.3
VCC  (57 unrouted)
  Top 1.016: 101.5,56 arc-92 56,10.5 arc-92 10.5,56 arc-92 56,101.5 arc-91 101.5,56
  pour Top (rank 2): 102.63,56.13 103.37,56.13 103.37,57.04 104.08,57.37 104.08,56.89 105.25,56.89 105.25,58.31 101.72,58.31 101.72,57.27 101.92,57.07 102.63,57.07
  pour Top (rank 2): 102.37,61 103.1,61.08 103,61.99 103.68,62.39 103.73,61.83 104.9,61.95 104.74,63.45 101.23,63.08 101.34,62.04 101.56,61.86 102.27,61.94
  pour Top (rank 2): 101.59,65.82 102.31,65.97 102.12,66.87 102.75,67.34 102.87,66.78 104.01,67.02 103.69,68.5 100.24,67.77 100.46,66.75 100.7,66.59 101.39,66.74
  pour Top (rank 2): 100.31,70.53 101.01,70.76 100.73,71.63 101.31,72.16 101.44,71.74 102.55,72.1 102.13,73.42 98.77,72.33 99.09,71.34 99.35,71.21 100.02,71.43
  pour Top (rank 2): 98.55,75.08 99.22,75.38 98.85,76.22 99.37,76.81 99.6,76.3 100.66,76.77 100.05,78.14 96.83,76.71 97.25,75.76 97.52,75.65 98.17,75.94
  pour Top (rank 2): 96.32,79.43 96.96,79.8 96.5,80.59 96.95,81.23 97.21,80.79 98.22,81.38 97.5,82.63 94.44,80.86 94.96,79.96 95.24,79.89 95.85,80.24
  pour Top (rank 2): 93.65,83.51 94.25,83.95 93.71,84.69 94.09,85.37 94.33,85.04 95.28,85.73 94.49,86.82 91.63,84.74 92.24,83.9 92.53,83.86 93.1,84.27
  pour Top (rank 2): 90.57,87.3 91.12,87.79 90.51,88.47 90.81,89.19 91.06,88.92 91.93,89.7 91.05,90.67 88.43,88.31 89.13,87.54 89.41,87.52 89.94,88
  pour Top (rank 2): 87.11,90.74 87.6,91.29 86.92,91.9 87.15,92.65 87.57,92.28 88.35,93.15 87.24,94.15 84.88,91.52 85.65,90.83 85.94,90.84 86.41,91.37
  pour Top (rank 2): 83.31,93.8 83.74,94.4 83,94.94 83.15,95.71 83.53,95.43 84.21,96.38 83.08,97.2 81,94.35 81.85,93.73 82.13,93.78 82.55,94.35
  pour Top (rank 2): 79.21,96.45 79.58,97.09 78.78,97.55 78.85,98.33 79.3,98.07 79.89,99.08 78.62,99.81 76.86,96.75 77.76,96.23 78.04,96.3 78.39,96.92
  pour Top (rank 2): 74.85,98.65 75.15,99.33 74.32,99.7 74.3,100.48 74.76,100.28 75.23,101.35 73.92,101.93 72.48,98.71 73.44,98.28 73.7,98.39 73.99,99.04
  pour Top (rank 2): 70.29,100.39 70.52,101.09 69.65,101.37 69.55,102.15 69.97,102.02 70.33,103.13 69.02,103.55 67.93,100.2 68.92,99.87 69.18,100.01 69.4,100.68
  pour Top (rank 2): 65.57,101.64 65.72,102.36 64.83,102.55 64.66,103.32 65.06,103.23 65.31,104.37 63.98,104.65 63.24,101.2 64.26,100.98 64.5,101.14 64.65,101.84
  pour Top (rank 2): 60.75,102.39 60.83,103.12 59.92,103.22 59.66,103.96 60.13,103.91 60.25,105.08 58.85,105.22 58.48,101.71 59.52,101.6 59.74,101.78 59.81,102.49
  pour Top (rank 2): 55.87,102.63 55.87,103.37 54.96,103.37 54.63,104.08 55.09,104.08 55.09,105.25 53.69,105.25 53.69,101.72 54.73,101.72 54.93,101.92 54.93,102.63
  pour Top (rank 2): 51,102.37 50.92,103.1 50.01,103 49.61,103.68 49.98,103.71 49.86,104.88 48.55,104.74 48.92,101.23 49.96,101.34 50.14,101.56 50.06,102.27
  pour Top (rank 2): 46.18,101.59 46.03,102.31 45.13,102.12 44.66,102.75 45.02,102.82 44.78,103.97 43.5,103.69 44.23,100.24 45.25,100.46 45.41,100.7 45.26,101.39
  pour Top (rank 2): 41.47,100.31 41.24,101.01 40.37,100.73 39.84,101.3 40.28,101.45 39.92,102.56 38.58,102.13 39.67,98.77 40.66,99.09 40.79,99.35 40.57,100.02
  pour Top (rank 2): 36.92,98.55 36.62,99.22 35.78,98.85 35.19,99.37 35.66,99.58 35.19,100.65 33.86,100.05 35.29,96.83 36.24,97.25 36.35,97.52 36.06,98.17
  pour Top (rank 2): 32.57,96.32 32.2,96.96 31.41,96.5 30.77,96.95 31.16,97.18 30.58,98.19 29.37,97.5 31.14,94.44 32.04,94.96 32.11,95.24 31.76,95.85
  pour Top (rank 2): 28.49,93.65 28.05,94.25 27.31,93.71 26.63,94.09 26.92,94.31 26.24,95.25 25.18,94.49 27.26,91.63 28.1,92.24 28.14,92.53 27.73,93.1
  pour Top (rank 2): 24.7,90.57 24.21,91.12 23.53,90.51 22.81,90.81 23.14,91.12 22.36,91.98 21.33,91.05 23.69,88.43 24.46,89.13 24.48,89.41 24,89.94
  pour Top (rank 2): 21.26,87.11 20.71,87.6 20.1,86.92 19.35,87.15 19.67,87.51 18.8,88.29 17.85,87.24 20.48,84.87 21.17,85.65 21.16,85.94 20.63,86.41
  pour Top (rank 2): 18.2,83.31 17.6,83.74 17.06,83 16.29,83.15 16.62,83.59 15.67,84.28 14.8,83.08 17.65,81 18.27,81.85 18.22,82.13 17.65,82.55
  pour Top (rank 2): 15.55,79.21 14.91,79.58 14.45,78.78 13.67,78.85 13.94,79.31 12.92,79.89 12.19,78.62 15.25,76.86 15.77,77.76 15.7,78.04 15.08,78.39
  pour Top (rank 2): 13.35,74.85 12.67,75.15 12.3,74.32 11.52,74.3 11.69,74.7 10.63,75.18 10.07,73.92 13.29,72.48 13.72,73.44 13.61,73.7 12.96,73.99
  pour Top (rank 2): 11.61,70.29 10.91,70.52 10.63,69.65 9.85,69.55 9.94,69.85 8.83,70.21 8.45,69.02 11.8,67.93 12.13,68.92 11.99,69.18 11.32,69.4
  pour Top (rank 2): 10.36,65.57 9.64,65.72 9.45,64.83 8.68,64.66 8.75,64.99 7.61,65.23 7.35,63.98 10.8,63.24 11.02,64.26 10.86,64.5 10.16,64.65
  pour Top (rank 2): 9.61,60.75 8.88,60.83 8.78,59.92 8.04,59.66 8.09,60.14 6.93,60.26 6.78,58.85 10.29,58.48 10.4,59.52 10.22,59.74 9.51,59.81
  pour Top (rank 2): 9.37,55.87 8.63,55.87 8.63,54.96 7.92,54.63 7.92,55.14 6.75,55.14 6.75,53.69 10.28,53.69 10.28,54.73 10.08,54.93 9.37,54.93
  pour Top (rank 2): 9.63,51 8.9,50.92 9,50.01 8.32,49.61 8.29,49.99 7.12,49.86 7.26,48.55 10.77,48.92 10.66,49.96 10.44,50.14 9.73,50.06
  pour Top (rank 2): 10.41,46.18 9.69,46.03 9.88,45.13 9.25,44.66 9.17,45.05 8.03,44.8 8.31,43.5 11.76,44.23 11.54,45.25 11.3,45.41 10.61,45.26
  pour Top (rank 2): 11.69,41.47 10.99,41.24 11.27,40.37 10.7,39.84 10.57,40.23 9.45,39.87 9.87,38.58 13.23,39.67 12.91,40.66 12.65,40.79 11.98,40.57
  pour Top (rank 2): 13.45,36.92 12.78,36.62 13.15,35.78 12.63,35.19 12.49,35.5 11.43,35.03 11.95,33.86 15.17,35.29 14.75,36.24 14.48,36.35 13.83,36.06
  pour Top (rank 2): 15.68,32.57 15.04,32.2 15.5,31.41 15.05,30.77 14.84,31.13 13.83,30.55 14.5,29.37 17.56,31.14 17.04,32.04 16.76,32.11 16.15,31.76
  pour Top (rank 2): 18.35,28.49 17.75,28.05 18.29,27.31 17.91,26.63 17.68,26.94 16.73,26.26 17.51,25.18 20.37,27.26 19.76,28.1 19.47,28.14 18.9,27.73
  pour Top (rank 2): 21.43,24.7 20.88,24.21 21.49,23.53 21.19,22.81 20.93,23.09 20.06,22.31 20.95,21.33 23.57,23.69 22.87,24.46 22.59,24.48 22.06,24
  pour Top (rank 2): 24.89,21.26 24.4,20.71 25.08,20.1 24.85,19.35 24.6,19.57 23.82,18.7 24.76,17.85 27.13,20.48 26.35,21.17 26.06,21.16 25.59,20.63
  pour Top (rank 2): 28.69,18.2 28.26,17.6 29,17.06 28.85,16.29 28.45,16.59 27.76,15.64 28.92,14.8 31,17.65 30.15,18.27 29.87,18.22 29.45,17.64
  pour Top (rank 2): 32.79,15.55 32.42,14.91 33.22,14.45 33.15,13.67 32.77,13.89 32.19,12.88 33.38,12.19 35.14,15.25 34.24,15.77 33.96,15.7 33.61,15.08
  pour Top (rank 2): 37.15,13.35 36.85,12.67 37.68,12.3 37.7,11.52 37.25,11.71 36.78,10.65 38.08,10.07 39.52,13.29 38.56,13.72 38.3,13.61 38.01,12.96
  pour Top (rank 2): 41.71,11.61 41.48,10.91 42.35,10.63 42.45,9.85 42.04,9.98 41.68,8.87 42.98,8.45 44.07,11.8 43.08,12.13 42.82,11.99 42.6,11.32
  pour Top (rank 2): 46.43,10.36 46.28,9.64 47.17,9.45 47.34,8.68 46.89,8.78 46.65,7.64 48.02,7.34 48.76,10.8 47.74,11.01 47.5,10.86 47.35,10.16
  pour Top (rank 2): 51.25,9.61 51.17,8.88 52.08,8.78 52.34,8.04 51.86,8.09 51.73,6.93 53.15,6.78 53.52,10.29 52.48,10.4 52.26,10.22 52.19,9.51
  pour Top (rank 2): 56.13,9.37 56.13,8.63 57.04,8.63 57.37,7.92 56.97,7.92 56.97,6.75 58.31,6.75 58.31,10.28 57.27,10.28 57.07,10.08 57.07,9.37
  pour Top (rank 2): 61,9.63 61.08,8.9 61.99,9 62.39,8.32 61.97,8.28 62.09,7.12 63.45,7.26 63.08,10.77 62.04,10.66 61.86,10.44 61.94,9.73
  pour Top (rank 2): 65.82,10.41 65.97,9.69 66.87,9.88 67.34,9.25 66.83,9.15 67.07,8 68.5,8.31 67.77,11.76 66.75,11.54 66.59,11.3 66.74,10.61
  pour Top (rank 2): 70.53,11.69 70.76,10.99 71.63,11.27 72.16,10.69 71.77,10.57 72.13,9.46 73.42,9.87 72.33,13.23 71.34,12.91 71.21,12.65 71.43,11.98
  pour Top (rank 2): 75.08,13.45 75.38,12.78 76.22,13.15 76.81,12.63 76.43,12.46 76.91,11.4 78.14,11.95 76.71,15.17 75.76,14.75 75.65,14.48 75.94,13.83
  pour Top (rank 2): 79.43,15.68 79.8,15.04 80.59,15.5 81.23,15.05 80.89,14.85 81.48,13.84 82.63,14.5 80.86,17.56 79.96,17.04 79.89,16.76 80.24,16.15
  pour Top (rank 2): 83.51,18.35 83.95,17.75 84.69,18.29 85.37,17.91 84.97,17.61 85.65,16.67 86.82,17.51 84.74,20.37 83.9,19.76 83.86,19.47 84.27,18.9
  pour Top (rank 2): 87.3,21.43 87.79,20.88 88.47,21.49 89.19,21.19 88.82,20.85 89.61,19.99 90.67,20.95 88.31,23.57 87.54,22.87 87.52,22.59 88,22.06
  pour Top (rank 2): 90.74,24.89 91.29,24.4 91.9,25.08 92.65,24.85 92.33,24.49 93.19,23.7 94.15,24.76 91.52,27.12 90.83,26.35 90.84,26.06 91.37,25.59
  pour Top (rank 2): 93.8,28.69 94.4,28.26 94.94,29 95.71,28.85 95.46,28.51 96.4,27.82 97.2,28.92 94.35,31 93.73,30.15 93.78,29.87 94.36,29.45
  pour Top (rank 2): 96.45,32.79 97.09,32.42 97.55,33.22 98.33,33.15 98.16,32.86 99.17,32.27 99.81,33.38 96.75,35.14 96.23,34.24 96.3,33.96 96.92,33.61
  pour Top (rank 2): 98.65,37.15 99.33,36.85 99.7,37.68 100.48,37.7 100.29,37.26 101.36,36.78 101.93,38.08 98.71,39.52 98.28,38.56 98.39,38.3 99.04,38.01
  pour Top (rank 2): 100.39,41.71 101.09,41.48 101.37,42.35 102.15,42.45 102.02,42.04 103.13,41.68 103.55,42.98 100.2,44.07 99.87,43.08 100.01,42.82 100.68,42.6
  pour Top (rank 2): 101.64,46.43 102.36,46.28 102.55,47.17 103.32,47.34 103.21,46.86 104.36,46.62 104.66,48.02 101.2,48.76 100.99,47.74 101.14,47.5 101.84,47.35
  pour Top (rank 2): 102.39,51.25 103.12,51.17 103.22,52.08 103.96,52.34 103.92,51.94 105.08,51.82 105.22,53.15 101.71,53.52 101.6,52.48 101.78,52.26 102.49,52.19
  pour Top (rank 3): 43.3,11.55 47.11,11.55 47.75,10.91 49.97,10.91 49.97,16.95 49.3,17.62 45.21,17.62 43.59,15.99 33.42,15.99 37.17,13.99 42.11,12.74 42.11,12.74
  pour Top: 94.1,73.14 94.1,69.97 95.37,68.7 99.82,68.7 99.82,69.33 99.5,69.65 99.5,70.6 99.18,70.92 99.18,71.87 97.91,73.14
WS2812
  Top 0.305: Q1.2 85.53,53.78 85.21,54.09 85.21,54.73 | 85.21,54.73 R8.2 | 85.21,54.73 85.21,55.36 86.07,56.23 88.79,56.23 IM1.12
WS2812-0
  pour Top: 103.53,64.47 103.38,65.15 104.36,65.38 104.46,64.9 107.52,62.79 107.57,62.27 106.38,62.14 106.33,62.67
WS2812-1
  pour Top: 102.41,69.37 102.25,69.88 103.17,70.2 103.26,69.92 106.52,68.14 106.63,67.66 105.46,67.41 105.36,67.89
WS2812-2
  pour Top: 100.77,74.15 100.53,74.68 101.41,75.1 101.55,74.78 104.98,73.36 105.12,72.9 103.99,72.53 103.84,72.99
WS2812-3
  pour Top: 98.62,78.73 98.3,79.28 99.14,79.79 99.34,79.44 102.89,78.38 103.12,77.86 102.03,77.38 101.8,77.89
WS2812-4
  pour Top: 95.96,83.07 95.57,83.6 96.38,84.22 96.65,83.84 100.3,83.16 100.57,82.69 99.54,82.09 99.26,82.56
WS2812-5
  pour Top: 92.9,87.11 92.44,87.62 93.18,88.32 93.52,87.94 97.22,87.64 97.45,87.32 96.49,86.62 96.24,86.95
WS2812-5V  (via drill 0.35)
  Top 0.254: Q1.3 v86.48,48.38 | v95.37,47.11 R9.2 | v106.8,58.54 107.34,58 U$61.DIN
  Bottom 0.254: v86.48,48.38 95.37,48.38 | 95.37,48.38 v95.37,47.11 | 95.37,48.38 99.18,48.38 101.72,50.92 101.72,56 102.99,57.27 105.53,57.27 v106.8,58.54
WS2812-6
  pour Top: 89.42,90.8 89.03,91.15 89.7,91.93 89.97,91.68 93.68,91.78 94.06,91.36 93.17,90.56 92.79,90.99
WS2812-7
  pour Top: 85.52,94.18 85.11,94.48 85.68,95.31 86.06,95.04 89.74,95.52 89.97,95.31 89.17,94.42 88.84,94.72
WS2812-8
  pour Top: 81.46,96.99 81,97.26 81.49,98.15 81.81,97.97 85.42,98.83 85.9,98.48 85.2,97.52 84.71,97.87
WS2812-9
  pour Top: 77.07,99.42 76.64,99.61 77.03,100.55 77.28,100.43 80.78,101.67 81.3,101.37 80.7,100.34 80.19,100.64
WS2812-10
  pour Top: 72.46,101.41 71.79,101.62 72.08,102.56 72.52,102.42 75.87,104.01 76.2,103.86 75.72,102.77 75.39,102.92
WS2812-11
  pour Top: 67.6,102.87 67.06,102.98 67.24,103.96 67.58,103.89 70.75,105.82 71.1,105.71 70.73,104.57 70.38,104.69
WS2812-12
  pour Top: 62.62,103.81 62.03,103.87 62.11,104.88 62.51,104.84 65.46,107.09 65.98,106.98 65.73,105.81 65.21,105.93
WS2812-13
  pour Top: 57.62,104.27 57.03,104.28 57.01,105.25 57.37,105.25 60.07,107.8 60.6,107.75 60.48,106.56 59.94,106.61
WS2812-14
  pour Top: 52.56,104.17 52.05,104.12 51.93,105.09 52.22,105.12 54.63,107.94 55.24,107.94 55.24,106.75 54.63,106.75
WS2812-15
  pour Top: 47.54,103.54 46.9,103.41 46.68,104.37 47.1,104.46 49.21,107.51 49.67,107.56 49.79,106.38 49.33,106.33
WS2812-16
  pour Top: 42.6,102.37 42.08,102.2 41.75,103.15 42.08,103.26 43.86,106.52 44.22,106.6 44.47,105.43 44.11,105.35
WS2812-17
  pour Top: 37.83,100.71 37.22,100.44 36.79,101.36 37.22,101.55 38.64,104.98 39.08,105.12 39.45,103.98 39.01,103.84
WS2812-18
  pour Top: 33.26,98.57 32.7,98.26 32.18,99.12 32.56,99.34 33.62,102.89 34.07,103.09 34.56,102 34.11,101.8
WS2812-19
  pour Top: 28.92,95.88 28.44,95.54 27.79,96.39 28.16,96.65 28.84,100.3 29.3,100.56 29.89,99.53 29.44,99.26
WS2812-20
  pour Top: 24.9,92.9 24.43,92.48 23.73,93.22 24.06,93.52 24.36,97.22 24.71,97.47 25.41,96.51 25.06,96.25
WS2812-21
  pour Top: 21.22,89.42 20.8,88.96 20.01,89.64 20.32,89.97 20.22,93.68 20.55,93.97 21.34,93.09 21.02,92.8
WS2812-22
  pour Top: 17.91,85.59 17.57,85.12 16.71,85.72 16.96,86.06 16.48,89.74 16.81,90.1 17.69,89.3 17.37,88.94
WS2812-23
  pour Top: 15.01,81.52 14.66,80.91 13.79,81.39 14.03,81.81 13.17,85.42 13.41,85.75 14.38,85.05 14.14,84.72
WS2812-24
  pour Top: 12.57,77.09 12.3,76.48 11.38,76.86 11.57,77.28 10.33,80.78 10.58,81.21 11.61,80.61 11.36,80.19
WS2812-25
  pour Top: 10.61,72.43 10.42,71.85 9.46,72.14 9.58,72.52 7.99,75.87 8.2,76.34 9.29,75.85 9.08,75.39
WS2812-26
  pour Top: 9.16,67.56 9.04,66.98 8.02,67.18 8.11,67.58 6.18,70.75 6.28,71.08 7.42,70.71 7.31,70.38
WS2812-27
  pour Top: 8.22,62.59 8.15,61.89 7.11,61.97 7.16,62.51 4.91,65.46 4.99,65.86 6.16,65.61 6.07,65.21
WS2812-28
  pour Top: 7.78,57.57 7.77,56.88 6.75,56.86 6.75,57.37 4.2,60.07 4.24,60.46 5.43,60.34 5.39,59.94
WS2812-29
  pour Top: 7.89,52.51 7.95,51.97 6.92,51.84 6.88,52.22 4.06,54.63 4.06,55.19 5.25,55.19 5.25,54.63
WS2812-30
  pour Top: 8.51,47.51 8.64,46.9 7.63,46.66 7.54,47.1 4.49,49.21 4.44,49.61 5.63,49.73 5.67,49.33
WS2812-31
  pour Top: 9.67,42.58 9.87,41.96 8.89,41.62 8.74,42.08 5.48,43.86 5.37,44.35 6.54,44.59 6.65,44.11
WS2812-32
  pour Top: 11.3,37.82 11.56,37.25 10.63,36.81 10.45,37.22 7.02,38.64 6.89,39.07 8.02,39.44 8.16,39.01
WS2812-33
  pour Top: 13.46,33.25 13.75,32.73 12.87,32.2 12.66,32.56 9.11,33.62 8.89,34.11 9.98,34.6 10.2,34.11
WS2812-34
  pour Top: 16.04,28.93 16.38,28.46 15.58,27.85 15.35,28.16 11.7,28.84 11.49,29.2 12.53,29.8 12.74,29.44
WS2812-35
  pour Top: 19.14,24.9 19.52,24.47 18.76,23.75 18.48,24.06 14.78,24.36 14.55,24.67 15.52,25.38 15.75,25.06
WS2812-36
  pour Top: 22.58,21.22 23.03,20.81 22.35,20.02 22.03,20.32 18.32,20.22 18.02,20.55 18.91,21.35 19.2,21.02
WS2812-37
  pour Top: 26.38,17.91 26.88,17.55 26.3,16.7 25.94,16.96 22.26,16.48 21.9,16.81 22.7,17.69 23.06,17.37
WS2812-38
  pour Top: 30.45,15 31.12,14.62 30.65,13.77 30.19,14.03 26.58,13.17 26.18,13.46 26.89,14.42 27.28,14.14
WS2812-39
  pour Top: 34.94,12.58 35.47,12.35 35.08,11.4 34.72,11.57 31.22,10.33 30.79,10.58 31.38,11.61 31.81,11.36
WS2812-40
  pour Top: 39.62,10.63 40.21,10.44 39.91,9.44 39.48,9.58 36.13,7.99 35.73,8.16 36.22,9.25 36.61,9.08
WS2812-41
  pour Top: 44.47,9.18 45.07,9.05 44.87,8.01 44.42,8.11 41.25,6.18 40.82,6.32 41.19,7.45 41.62,7.31
WS2812-42
  pour Top: 49.41,8.22 50.19,8.13 50.11,7.1 49.49,7.16 46.54,4.91 46,5.02 46.25,6.19 46.79,6.07
WS2812-43
  pour Top: 54.43,7.78 55.19,7.77 55.22,6.75 54.63,6.75 51.93,4.2 51.36,4.26 51.49,5.45 52.06,5.39
WS2812-44
  pour Top: 59.5,7.9 60.1,7.96 60.23,6.92 59.78,6.88 57.37,4.06 56.86,4.06 56.86,5.25 57.37,5.25
WS2812-45
  pour Top: 64.49,8.51 64.98,8.62 65.22,7.61 64.9,7.54 62.79,4.48 62.38,4.44 62.25,5.63 62.67,5.67
WS2812-46
  pour Top: 69.42,9.67 70.04,9.87 70.38,8.89 69.92,8.74 68.14,5.48 67.58,5.36 67.33,6.53 67.89,6.64
WS2812-48
  pour Top: 78.74,13.43 79.32,13.76 79.84,12.9 79.44,12.66 78.38,9.11 77.97,8.92 77.48,10.01 77.89,10.2
WS2812-49
  pour Top: 83.07,16.07 83.61,16.45 84.23,15.63 83.84,15.35 83.16,11.7 82.8,11.49 82.2,12.53 82.56,12.74
WS2812-50
  pour Top: 87.1,19.11 87.53,19.5 88.24,18.75 87.94,18.48 87.64,14.78 87.33,14.56 86.63,15.52 86.94,15.75
WS2812-51
  pour Top: 90.78,22.57 91.26,23.09 92.03,22.42 91.68,22.03 91.78,18.32 91.47,18.04 90.67,18.93 90.98,19.2
WS2812-52
  pour Top: 94.09,26.38 94.53,26.99 95.38,26.41 95.04,25.94 95.52,22.26 95.14,21.84 94.25,22.64 94.63,23.06
WS2812-53
  pour Top: 96.98,30.53 97.28,31.05 98.18,30.56 97.97,30.19 98.83,26.58 98.58,26.24 97.62,26.94 97.86,27.28
WS2812-54
  pour Top: 99.42,34.94 99.72,35.63 100.67,35.23 100.43,34.72 101.67,31.22 101.44,30.82 100.41,31.42 100.64,31.81
WS2812-55
  pour Top: 101.38,39.6 101.51,40 102.49,39.71 102.42,39.48 104.01,36.13 103.81,35.67 102.72,36.15 102.92,36.61
WS2812-56
  pour Top: 102.83,44.46 102.94,44.97 103.97,44.78 103.89,44.42 105.82,41.25 105.68,40.8 104.54,41.17 104.69,41.62
WS2812-57
  pour Top: 103.8,49.39 103.87,50.05 104.89,49.97 104.84,49.49 107.09,46.54 107.01,46.13 105.84,46.38 105.93,46.79
WS2812-58
  pour Top: 104.3,54.35 104.3,55.17 105.25,55.19 105.25,54.63 107.8,51.93 107.76,51.52 106.57,51.64 106.61,52.06